# Altium project USBHUB.PrjPcb
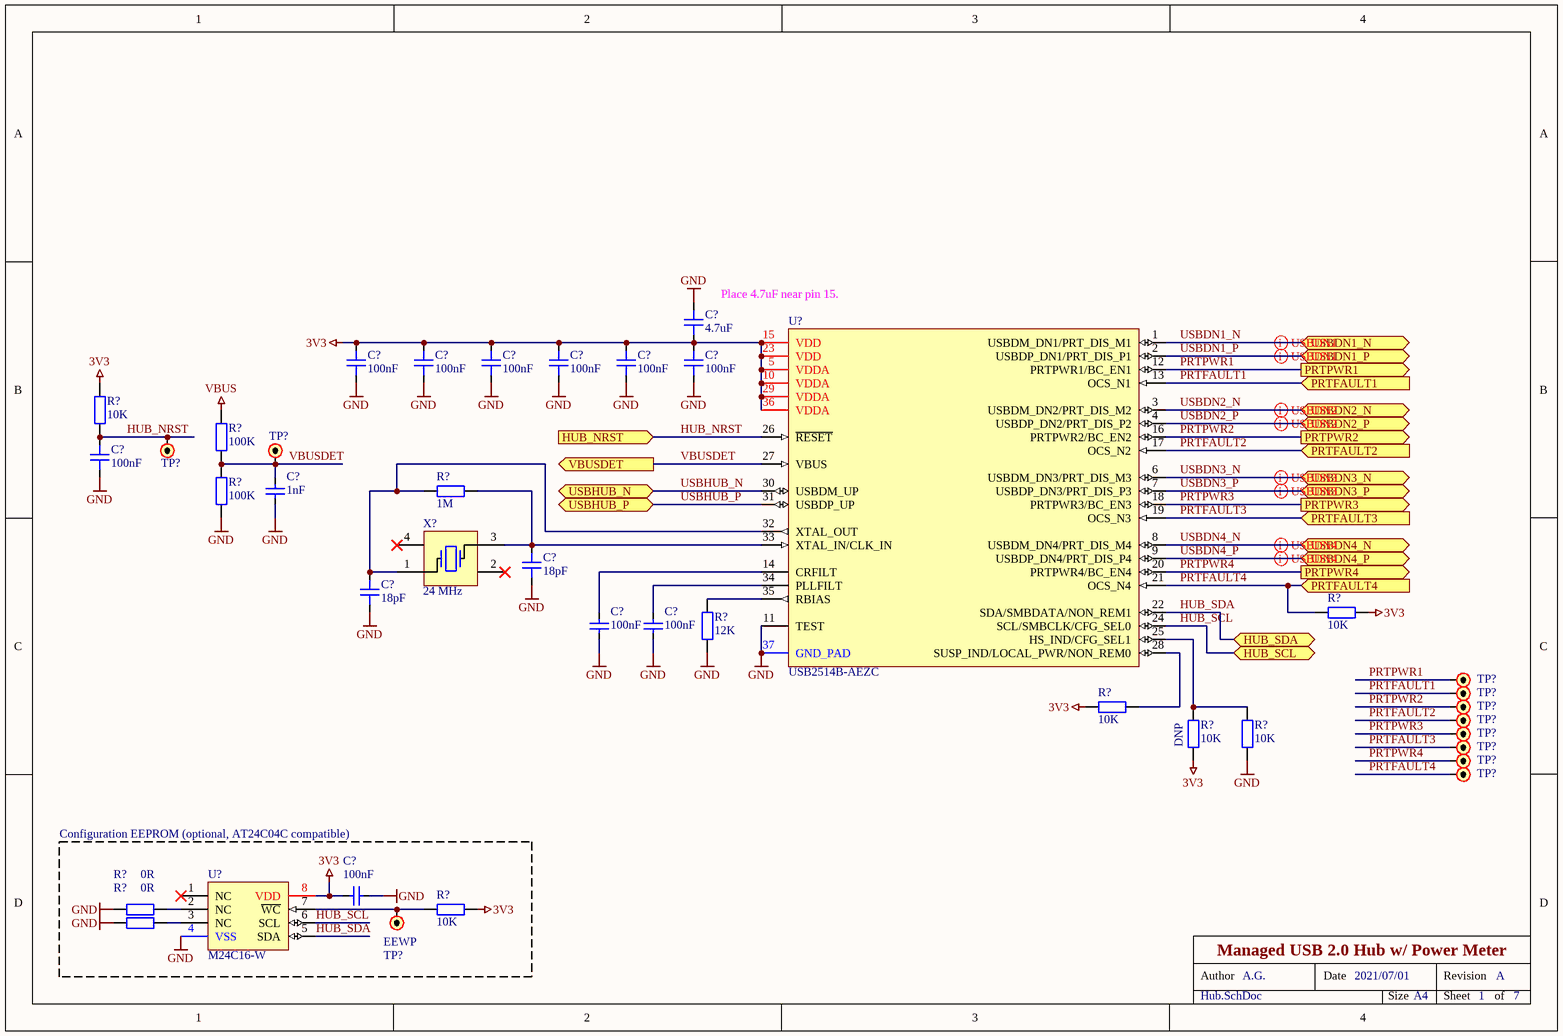
[diagram p0: Hub.SchDoc]
Title: Managed USB 2.0 Hub w/ Power Meter; Revision: A; DrawnBy: A.G.; Date: 2021/07/01
8 sheets, 301 parts. Net scope: flat (ports and power ports of the same name join across sheets).
Board file: USBHUB.PcbDoc
Sheets:
  Hub.SchDoc
  Control.SchDoc
  Ports.SchDoc
  PowerSupply.SchDoc
  PortSwitch.SchDoc
  UpstreamPort.SchDoc
  SMPS.SchDoc
  Decoration.SchDoc

## Sheet Hub.SchDoc: Managed USB 2.0 Hub w/ Power Meter
size A4; Date: 2021/07/01; DrawnBy: A.G.; DocumentNumber: 1; Revision: A; SheetNumber: 1; SheetTotal: 7; ProjectName: USBHUB.PrjPcb

### Parts
(Parts that share a designator on the sheet are numbered #1, #2 ... from top to bottom, then left to right.)
C?#1  4.7uF  [0603C_RF_M]
C?#2  100nF  [0603C_RF_M]
C?#3  100nF  [0603C_RF_M]
C?#4  100nF  [0603C_RF_M]
C?#5  100nF  [0603C_RF_M]
C?#6  100nF  [0603C_RF_M]
C?#7  100nF  [0603C_RF_M]
C?#8  100nF  [0603C_RF_M]
C?#9  1nF  [0603C_RF_M]
C?#10  18pF  [0603C_RF_M]
C?#11  18pF  [0603C_RF_M]
C?#12  100nF  [0603C_RF_M]
C?#13  100nF  [0603C_RF_M]
C?#14  100nF  [0603C_RF_M]
R?#1  10K  [0603R_RF_M]
R?#2  100K  [0603R_RF_M]
R?#3  1M  [0603R_RF_M]
R?#4  100K  [0603R_RF_M]
R?#5  10K  [0603R_RF_M]
R?#6  12K  [0603R_RF_M]
R?#7  10K  [0603R_RF_M]
R?#8  10K  [0603R_RF_M]
R?#9  10K  [0603R_RF_M]
R?#10  0R  [0603R_RF_M]
R?#11  10K  [0603R_RF_M]
R?#12  0R  [0603R_RF_M]
TP?#1  Test Point  [PAD_R_1MM]  (value not drawn)
TP?#2  Test Point  [PAD_R_1.5MM]  (value not drawn)
TP?#3  Test Point  [PAD_R_1.5MM]  (value not drawn)
TP?#4  Test Point  [PAD_R_1.5MM]  (value not drawn)
TP?#5  Test Point  [PAD_R_1.5MM]  (value not drawn)
TP?#6  Test Point  [PAD_R_1.5MM]  (value not drawn)
TP?#7  Test Point  [PAD_R_1.5MM]  (value not drawn)
TP?#8  Test Point  [PAD_R_1.5MM]  (value not drawn)
TP?#9  Test Point  [PAD_R_1.5MM]  (value not drawn)
TP?#10  Test Point  [PAD_R_1.5MM]  (value not drawn)
TP?#11  EEWP  [PAD_R_1.5MM]
U?#1  USB2514B-AEZC  [MCHP_USB2514B-QFN-36]
U?#2  M24C16-W  [SO-8-SOIC127P600X175-8N]
X?#1  24 MHz  [XTAL_5032]

### Blocks framed on the sheet
Configuration EEPROM (optional, AT24C04C compatible): C?#14 R?#10-R?#12 TP?#11 U?#2

### Ports
HUB_NRST (in), HUB_SCL (bidir), HUB_SDA (bidir), PRTFAULT1 (in), PRTFAULT2 (in), PRTFAULT3 (in), PRTFAULT4 (in), PRTPWR1 (out), PRTPWR2 (out), PRTPWR3 (out), PRTPWR4 (out), USBDN1_N (bidir), USBDN1_P (bidir), USBDN2_N (bidir), USBDN2_P (bidir), USBDN3_N (bidir), USBDN3_P (bidir), USBDN4_N (bidir), USBDN4_P (bidir), USBHUB_N (bidir), USBHUB_P (bidir), VBUSDET (out)

### Nets
3V3: C?#1.2 C?#2.2 C?#3.2 C?#4.2 C?#5.2 C?#6.2 C?#7.2 C?#14.2 R?#1.2 R?#5.1 R?#7.1 R?#8.1 R?#11.2 U?#1.5(VDDA) U?#1.10(VDDA) U?#1.15(VDD) U?#1.23(VDD) U?#1.29(VDDA) U?#1.36(VDDA) U?#2.8(VDD)
GND: C?#1.1 C?#2.1 C?#3.1 C?#4.1 C?#5.1 C?#6.1 C?#7.1 C?#8.1 C?#9.1 C?#10.1 C?#11.1 C?#12.1 C?#13.1 C?#14.1 R?#4.1 R?#6.1 R?#9.1 R?#10.1 R?#12.1 U?#1.11(TEST) U?#1.37(GND_PAD) U?#2.4(VSS)
VBUS: R?#2.2
HUB_NRST: C?#8.2 R?#1.1 TP?#1.1 U?#1.26(~{RESET}) ; port HUB_NRST
HUB_SCL: U?#1.24(SCL/SMBCLK/CFG_SEL0) U?#2.6(SCL) ; port HUB_SCL
HUB_SDA: U?#1.22(SDA/SMBDATA/NON_REM1) U?#2.5(SDA) ; port HUB_SDA
PRTFAULT1: TP?#4.1 U?#1.13(OCS_N1) ; port PRTFAULT1
PRTFAULT2: TP?#6.1 U?#1.17(OCS_N2) ; port PRTFAULT2
PRTFAULT3: TP?#8.1 U?#1.19(OCS_N3) ; port PRTFAULT3
PRTFAULT4: R?#5.2 TP?#10.1 U?#1.21(OCS_N4) ; port PRTFAULT4
PRTPWR1: TP?#3.1 U?#1.12(PRTPWR1/BC_EN1) ; port PRTPWR1
PRTPWR2: TP?#5.1 U?#1.16(PRTPWR2/BC_EN2) ; port PRTPWR2
PRTPWR3: TP?#7.1 U?#1.18(PRTPWR3/BC_EN3) ; port PRTPWR3
PRTPWR4: TP?#9.1 U?#1.20(PRTPWR4/BC_EN4) ; port PRTPWR4
USBDN1_N: U?#1.1(USBDM_DN1/PRT_DIS_M1) ; port USBDN1_N
USBDN1_P: U?#1.2(USBDP_DN1/PRT_DIS_P1) ; port USBDN1_P
USBDN2_N: U?#1.3(USBDM_DN2/PRT_DIS_M2) ; port USBDN2_N
USBDN2_P: U?#1.4(USBDP_DN2/PRT_DIS_P2) ; port USBDN2_P
USBDN3_N: U?#1.6(USBDM_DN3/PRT_DIS_M3) ; port USBDN3_N
USBDN3_P: U?#1.7(USBDP_DN3/PRT_DIS_P3) ; port USBDN3_P
USBDN4_N: U?#1.8(USBDM_DN4/PRT_DIS_M4) ; port USBDN4_N
USBDN4_P: U?#1.9(USBDP_DN4/PRT_DIS_P4) ; port USBDN4_P
USBHUB_N: U?#1.30(USBDM_UP) ; port USBHUB_N
USBHUB_P: U?#1.31(USBDP_UP) ; port USBHUB_P
VBUSDET: C?#9.2 R?#2.1 R?#4.2 TP?#2.1 U?#1.27(VBUS) ; port VBUSDET
NetC?#10_2: C?#10.2 R?#3.2 U?#1.33(XTAL_IN/CLK_IN) X?#1.3(X2)
NetC?#11_2: C?#11.2 R?#3.1 U?#1.32(XTAL_OUT) X?#1.1(X1)
NetC?#12_2: C?#12.2 U?#1.14(CRFILT)
NetC?#13_2: C?#13.2 U?#1.34(PLLFILT)
NetR?#6_2: R?#6.2 U?#1.35(RBIAS)
NetR?#7_2: R?#7.2 U?#1.28(SUSP_IND/LOCAL_PWR/NON_REM0)
NetR?#8_2: R?#8.2 R?#9.2 U?#1.25(HS_IND/CFG_SEL1)
NetR?#10_2: R?#10.2 U?#2.2(NC)
NetR?#11_1: R?#11.1 TP?#11.1 U?#2.7(~{WC})
NetR?#12_2: R?#12.2 U?#2.3(NC)

Not connected (* = marked no-connect by the designer): U?#2 1(NC)*; X?#1 2(GND)* 4(GND)*

### Layout directives
differential pair: USBDN1_N, USBDN1_P, USBDN2_N, USBDN2_P, USBDN3_N, USBDN3_P, USBDN4_N, USBDN4_P

### Notes on the sheet
- Place 4.7uF near pin 15.
- (near R?#8) DNP
- Author
- Date
- Revision
- Size
- A4
- Sheet
- of

### Library data of the parts
C?#1-C?#14 = C: Capacitor; Manufacturer: Generic Brand; Max Voltage: ? V; Tolerance: ?; Mounting Technology: SMT; Tag: *; Manufacturer Part No: *; Supplier: *; Supplier Link: http://; Supplier Part No: *; Category: Capacitor
  C?#1: Value: 4.7uF
  C?#2-C?#8 C?#12-C?#14: Value: 100nF
  C?#9: Value: 1nF
  C?#10 C?#11: Value: 18pF
R?#1-R?#12 = R: Resistor; Manufacturer: Generic Brand; Power Rating: ? W; Max Voltage: ? V; Tolerance: ?; Supplier Link: http://; Category: Resistor; Mounting Technology: SMT
  R?#1 R?#5 R?#7-R?#9 R?#11: Value: 10K
  R?#2 R?#4: Value: 100K
  R?#3: Value: 1M
  R?#6: Value: 12K
  R?#10 R?#12: Value: 0R
TP?#1-TP?#11 = Test Point: Test Point / Pad
U?#1 = USB2514B-AEZC: USB 2.0 Hub Controller; Manufacturer: Microchip; Supplier Link: https://www.chipdip.by/product/usb2514b-aezc-microchip; Supplier Part No: 9000221010; Mounting Type: SMT; Case: QFN-36; Supplier: Chipdip; Product Name: USB2514B-AEZC
U?#2 = M24C16-W: IC SRL EEPROM 16KBIT 2.5V 8-SOIC; Manufacturer: STMicroelectronics; Manufacturer Product Number: M24C16-WMN6TP; Base Product Number: M24C16; Supplier: DigiKey; Supplier URL: https://www.digikey.com/en/products/detail/stmicroelectronics/M24C16-WMN6TP/1007246; Supplier Part No: 497-17785-1-ND; Supplier Package: Cut Tape; Mounting Type: SMT; Operating Temperature: -40°C ~ 85°C (TA); Supplier Price: $0.14
X?#1 = XT-4P: Crystal Resonator (4 Leads); Manufacturer: Generic Brand; Tolerance: ? ppm; Mounting Technology: SMT; Supplier Link: http://; Category: Crystal; Value: 24 MHz

## Sheet Control.SchDoc: Managed USB 2.0 Hub w/ Power Meter
size A4; Date: 2021/07/01; DrawnBy: A.G.; DocumentNumber: 1; Revision: A; SheetNumber: 2; SheetTotal: 7; ProjectName: USBHUB.PrjPcb
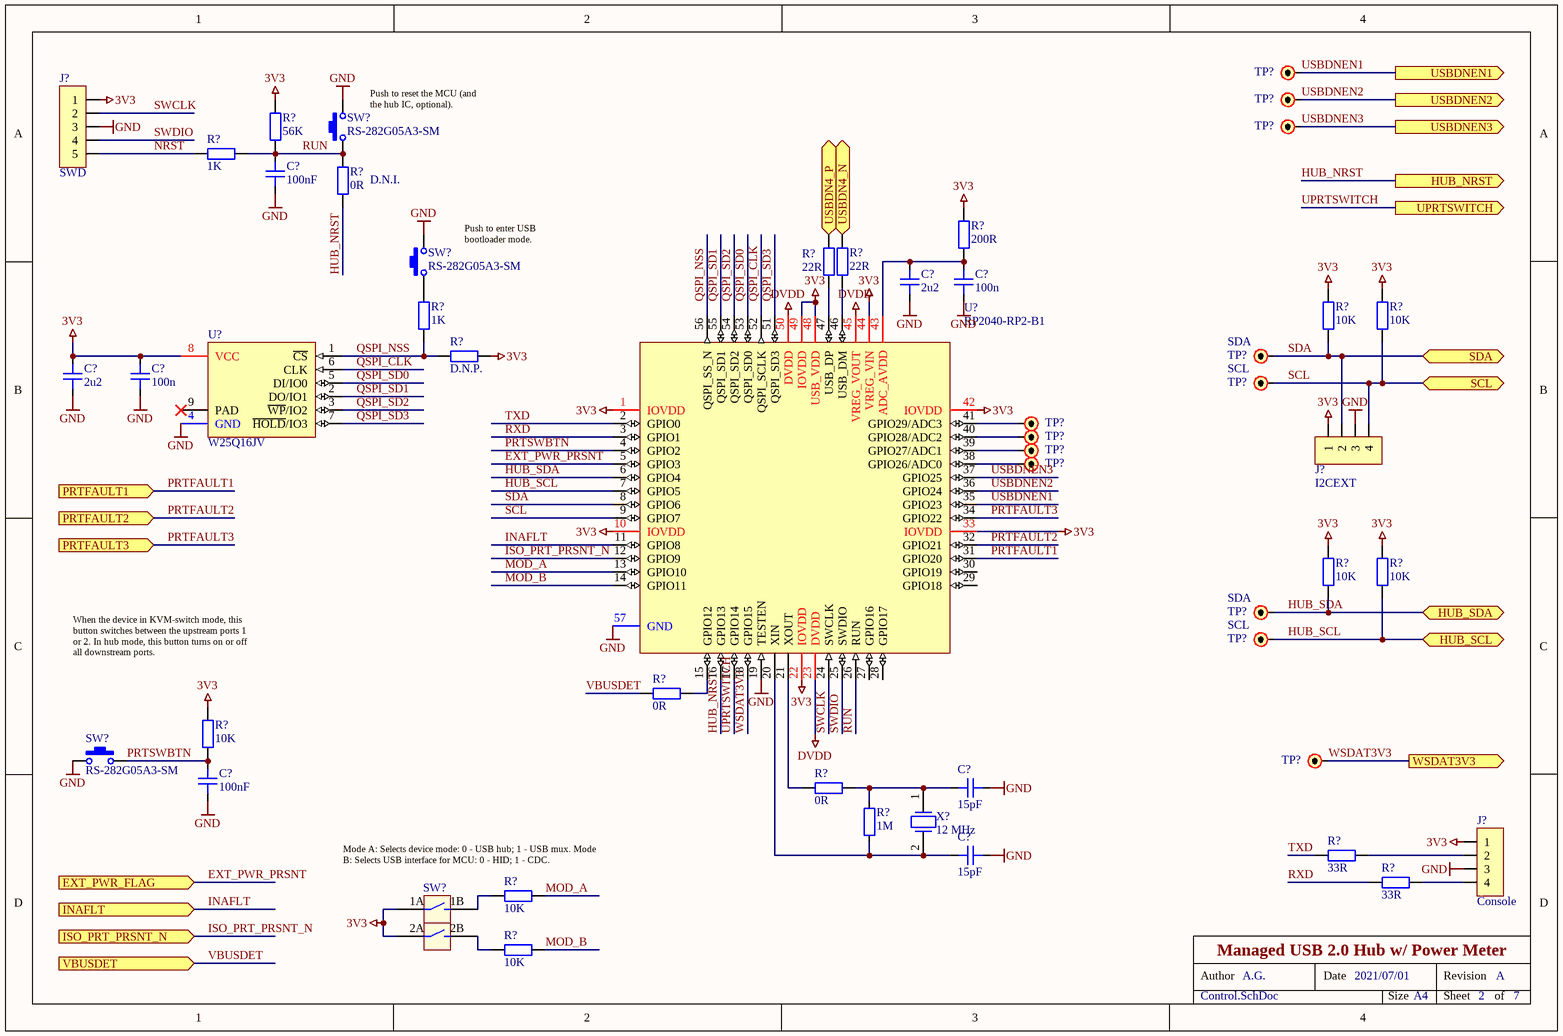
[diagram p1: Control.SchDoc]

### Parts
(Parts that share a designator on the sheet are numbered #1, #2 ... from top to bottom, then left to right.)
C?#15  100nF  [0603C_RF_M]
C?#16  2u2  [0805C_RF_M]
C?#17  100n  [0805C_RF_M]
C?#18  2u2  [0603C_RF_M]
C?#19  100n  [0603C_RF_M]
C?#20  100nF  [0603C_RF_M]
C?#21  15pF  [0603C_RF_M]
C?#22  15pF  [0603C_RF_M]
J?#1  SWD  [HEADER-2.54-5P1]
J?#2  I2CEXT  [HEADER-2.54-4P1]
J?#3  Console  [HEADER-2.54-4P1]
R?#13  56K  [0603R_RF_M]
R?#14  1K  [0603R_RF_M]
R?#15  0R  [0603R_RF_M]
R?#16  200R  [0805R_RF_M]
R?#17  1K  [0603R_RF_M]
R?#18  22R  [0805R_RF_M]
R?#19  22R  [0805R_RF_M]
R?#20  10K  [0603R_RF_M]
R?#21  10K  [0603R_RF_M]
R?#22  D.N.P.  [0603R_RF_M]
R?#23  10K  [0603R_RF_M]
R?#24  10K  [0603R_RF_M]
R?#25  0R  [0805R_RF_M]
R?#26  10K  [0805R_RF_M]
R?#27  0R  [0805R_RF_M]
R?#28  1M  [0805R_RF_M]
R?#29  33R  [0805R_RF_M]
R?#30  33R  [0805R_RF_M]
R?#31  10K  [0805R_RF_M]
R?#32  10K  [0805R_RF_M]
SW?#1  RS-282G05A3-SM  [RS-282G05A3-SM]
SW?#2  RS-282G05A3-SM  [RS-282G05A3-SM]
SW?#3  RS-282G05A3-SM  [RS-282G05A3-SM]
SW?#4  WURTH_418117270902  [WURTH_418117270902]  (value not drawn)
TP?#12  Test Point  [PAD_R_1MM]  (value not drawn)
TP?#13  Test Point  [PAD_R_1MM]  (value not drawn)
TP?#14  Test Point  [PAD_R_1MM]  (value not drawn)
TP?#15  SDA  [PAD_R_1.5MM]
TP?#16  SCL  [PAD_R_1.5MM]
TP?#17  Test Point  [PAD_R_1MM]  (value not drawn)
TP?#18  Test Point  [PAD_R_1MM]  (value not drawn)
TP?#19  Test Point  [PAD_R_1MM]  (value not drawn)
TP?#20  Test Point  [PAD_R_1MM]  (value not drawn)
TP?#21  SDA  [PAD_R_1.5MM]
TP?#22  SCL  [PAD_R_1.5MM]
TP?#23  Test Point  [PAD_R_1MM]  (value not drawn)
U?#3  W25Q16JV  [MCHP_USON-8]
U?#4  RP2040-RP2-B1  [RP2040-QFN-56]
X?#2  12 MHz  [XTAL_3215]

### Ports
EXT_PWR_FLAG (in), HUB_NRST (out), HUB_SCL (bidir), HUB_SDA (bidir), INAFLT (in), ISO_PRT_PRSNT_N (in), PRTFAULT1 (in), PRTFAULT2 (in), PRTFAULT3 (in), SCL (bidir), SDA (bidir), UPRTSWITCH (out), USBDN4_N (bidir), USBDN4_P (bidir), USBDNEN1 (out), USBDNEN2 (out), USBDNEN3 (out), VBUSDET (in), WSDAT3V3 (out)

### Nets
3V3: C?#18.2 C?#19.2 J?#1.1 J?#2.1 J?#3.1 R?#13.1 R?#16.2 R?#20.2 R?#21.2 R?#22.1 R?#23.2 R?#24.2 R?#26.2 U?#3.8(VCC) U?#4.1(IOVDD) U?#4.10(IOVDD) U?#4.22(IOVDD) U?#4.33(IOVDD) U?#4.42(IOVDD) U?#4.44(VREG_VIN) U?#4.48(USB_VDD) U?#4.49(IOVDD)
DVDD: U?#4.23(DVDD) U?#4.45(VREG_VOUT) U?#4.50(DVDD)
GND: C?#15.1 C?#16.1 C?#17.1 C?#18.1 C?#19.1 C?#20.2 C?#21.2 C?#22.2 J?#1.3 J?#2.3 J?#3.3 SW?#1.2 SW?#2.2 SW?#3.1 U?#3.4(GND) U?#4.19(TESTEN) U?#4.57(GND)
EXT_PWR_PRSNT: U?#4.5(GPIO3) ; port EXT_PWR_FLAG
HUB_NRST: R?#15.2 U?#4.16(GPIO13) ; port HUB_NRST
HUB_SCL: R?#24.1 TP?#22.1 U?#4.7(GPIO5) ; port HUB_SCL
HUB_SDA: R?#23.1 TP?#21.1 U?#4.6(GPIO4) ; port HUB_SDA
INAFLT: U?#4.11(GPIO8) ; port INAFLT
ISO_PRT_PRSNT_N: U?#4.12(GPIO9) ; port ISO_PRT_PRSNT_N
MOD_A: R?#31.2 U?#4.13(GPIO10)
MOD_B: R?#32.2 U?#4.14(GPIO11)
NRST: J?#1.5 R?#14.2
PRTFAULT1: U?#4.31(GPIO20) ; port PRTFAULT1
PRTFAULT2: U?#4.32(GPIO21) ; port PRTFAULT2
PRTFAULT3: U?#4.34(GPIO22) ; port PRTFAULT3
PRTSWBTN: C?#20.1 R?#26.1 SW?#3.2 U?#4.4(GPIO2)
QSPI_CLK: U?#3.6(CLK) U?#4.52(QSPI_SCLK)
QSPI_NSS: R?#17.2 R?#22.2 U?#3.1(~{CS}) U?#4.56(QSPI_SS_N)
QSPI_SD0: U?#3.5(DI/IO0) U?#4.53(QSPI_SD0)
QSPI_SD1: U?#3.2(DO/IO1) U?#4.55(QSPI_SD1)
QSPI_SD2: U?#3.3(~{WP}/IO2) U?#4.54(QSPI_SD2)
QSPI_SD3: U?#3.7(~{HOLD}/IO3) U?#4.51(QSPI_SD3)
RUN: C?#15.2 R?#13.2 R?#14.1 R?#15.1 SW?#1.1 U?#4.26(RUN)
RXD: R?#30.1 U?#4.3(GPIO1)
SCL: J?#2.4 R?#21.1 TP?#16.1 U?#4.9(GPIO7) ; port SCL
SDA: J?#2.2 R?#20.1 TP?#15.1 U?#4.8(GPIO6) ; port SDA
SWCLK: J?#1.2 U?#4.24(SWCLK)
SWDIO: J?#1.4 U?#4.25(SWDIO)
TXD: R?#29.1 U?#4.2(GPIO0)
UPRTSWITCH: U?#4.17(GPIO14) ; port UPRTSWITCH
USBDN4_N: R?#19.2 ; port USBDN4_N
USBDN4_P: R?#18.2 ; port USBDN4_P
USBDNEN1: TP?#12.1 U?#4.35(GPIO23) ; port USBDNEN1
USBDNEN2: TP?#13.1 U?#4.36(GPIO24) ; port USBDNEN2
USBDNEN3: TP?#14.1 U?#4.37(GPIO25) ; port USBDNEN3
VBUSDET: R?#25.2 ; port VBUSDET
WSDAT3V3: TP?#23.1 U?#4.18(GPIO15) ; port WSDAT3V3
NetC?#16_2: C?#16.2 C?#17.2 R?#16.1 U?#4.43(ADC_AVDD)
NetC?#21_1: C?#21.1 R?#27.1 R?#28.2 X?#2.1
NetC?#22_1: C?#22.1 R?#28.1 U?#4.20(XIN) X?#2.2
NetJ?#3_2: J?#3.2 R?#29.2
NetJ?#3_4: J?#3.4 R?#30.2
NetR?#17_1: R?#17.1 SW?#2.1
NetR?#18_1: R?#18.1 U?#4.47(USB_DP)
NetR?#19_1: R?#19.1 U?#4.46(USB_DM)
NetR?#25_1: R?#25.1 U?#4.15(GPIO12)
NetR?#27_2: R?#27.2 U?#4.21(XOUT)
NetTP?#17_1: TP?#17.1 U?#4.41(GPIO29/ADC3)
NetTP?#18_1: TP?#18.1 U?#4.40(GPIO28/ADC2)
NetTP?#19_1: TP?#19.1 U?#4.39(GPIO27/ADC1)
NetTP?#20_1: TP?#20.1 U?#4.38(GPIO26/ADC0)

Not connected (* = marked no-connect by the designer): R?#31 1; R?#32 1; SW?#4 1A 1B 2A 2B; U?#3 9(PAD)*; U?#4 27(GPIO16) 28(GPIO17) 29(GPIO18) 30(GPIO19)

### Notes on the sheet
- (near SW?#1) Push to reset the MCU (and the hub IC, optional).
- D.N.I.
- (near SW?#2) Push to enter USB bootloader mode.
- When the device in KVM-switch mode, this button switches between the upstream ports 1 or 2. In hub mode, this button turns on or off all downstream ports.
- Mode A: Selects device mode: 0 - USB hub; 1 - USB mux. Mode B: Selects USB interface for MCU: 0 - HID; 1 - CDC.
- Author
- Date
- Revision
- Size
- A4
- Sheet
- of

### Library data of the parts
C?#15-C?#22 = C: as C?#1 on sheet Hub; Tolerance: ?; Mounting Technology: SMT; Tag: *; Manufacturer Part No: *; Supplier: *; Supplier Link: http://; Supplier Part No: *; Category: Capacitor
  C?#15 C?#20: Value: 100nF
  C?#16 C?#18: Value: 2u2
  C?#17 C?#19: Value: 100n
  C?#21 C?#22: Value: 15pF
J?#1 = PINHDR-5P1: Generic Pin Header 5x1
J?#2 J?#3 = PINHDR-4P1: Generic Pin Header 4x1
R?#13-R?#32 = R: as R?#1 on sheet Hub; Tolerance: ?; Supplier Link: http://; Category: Resistor; Mounting Technology: SMT
  R?#13: Value: 56K
  R?#14 R?#17: Value: 1K
  R?#15 R?#25 R?#27: Value: 0R
  R?#16: Value: 200R
  R?#18 R?#19: Value: 22R
  R?#20 R?#21 R?#23 R?#24 R?#26 R?#31 R?#32: Value: 10K
  R?#22: Value: D.N.P.
  R?#28: Value: 1M
  R?#29 R?#30: Value: 33R
SW?#1-SW?#3 = RS-282G05A3-SM: SWITCH TACTILE SPST-NO 0.05A 12V; Manufacturer: C&K; Product Number: RS-282G05A3-SM RT; Supplier: DigiKey; Supplier Link: https://www.digikey.com/en/products/detail/c-k/RS-282G05A3-SM-RT/2747190; Supplier Part No: CKN10384CT-ND; Mounting Technology: SMT; Package: Non-Standard
SW?#4 = WURTH_418117270902: DIP SWITCH SPST 2.54 PITCH RA; Manufacturer: Wurth Elektronik; Compatible Product: DS1040-02RN; Product Number: 418117270902; Mounting Technology: SMT; Package: DIP-4; Supplier: DigiKey; Supplier Link: https://www.digikey.com/en/products/detail/w%C3%BCrth-elektronik/418117270902/3174485; Supplier Part No: 732-3832-5-ND; Alternative Supplier: Chipdip; Alternative Supplier Part No: 9000190955; Alternative Supplier Link: https://www.chipdip.by/product/ds1040-02rn
TP?#12-TP?#23 = Test Point: Test Point / Pad
U?#3 = W25Q16JV: IC FLASH 16MBIT SPI/QUAD 8USON
U?#4 = RP2040-RP2-B1: IC MCU; Manufacturer: Raspberry Pi Foundation; Supplier: DigiKey; Package: VFQFN-56; Mounting Technology: SMT
X?#2 = XT-2P: Crystal Resonator (2 Leads); Manufacturer: Generic Brand; Tolerance: ? ppm; Mounting Technology: SMT; Supplier Link: http://; Category: Crystal; Value: 12 MHz

## Sheet Ports.SchDoc: Managed USB 2.0 Hub w/ Power Meter
size A4; Date: 2021/07/01; DrawnBy: A.G.; DocumentNumber: 1; Revision: A; SheetNumber: 3; SheetTotal: 7; ProjectName: USBHUB.PrjPcb
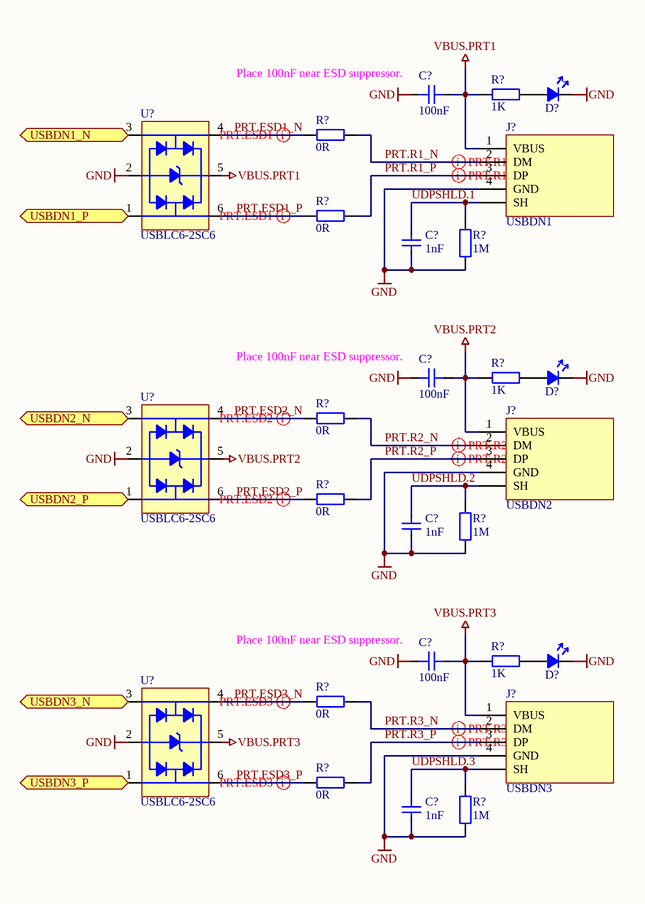
[diagram p2: Ports.SchDoc]

### Parts
(Parts that share a designator on the sheet are numbered #1, #2 ... from top to bottom, then left to right.)
C?#23  100nF  [0603C_RF_M]
C?#24  1nF  [0603C_RF_M]
C?#25  100nF  [0603C_RF_M]
C?#26  1nF  [0603C_RF_M]
C?#27  100nF  [0603C_RF_M]
C?#28  1nF  [0603C_RF_M]
D?#1  Unspecified  [0805LED_RF_M]  (value not drawn)
D?#2  Unspecified  [0805LED_RF_M]  (value not drawn)
D?#3  Unspecified  [0805LED_RF_M]  (value not drawn)
J?#4  USBDN1  [SAMTEC_USB-A-S-X-X-TH]
J?#5  USBDN2  [SAMTEC_USB-A-S-X-X-TH]
J?#6  USBDN3  [SAMTEC_USB-A-S-X-X-TH]
R?#33  1K  [0603R_RF_M]
R?#34  0R  [0603R_RF_M]
R?#35  0R  [0603R_RF_M]
R?#36  1M  [0603R_RF_M]
R?#37  1K  [0603R_RF_M]
R?#38  0R  [0603R_RF_M]
R?#39  0R  [0603R_RF_M]
R?#40  1M  [0603R_RF_M]
R?#41  1K  [0603R_RF_M]
R?#42  0R  [0603R_RF_M]
R?#43  0R  [0603R_RF_M]
R?#44  1M  [0603R_RF_M]
U?#5  USBLC6-2SC6  [TI_SOT-23-6]
U?#6  USBLC6-2SC6  [TI_SOT-23-6]
U?#7  USBLC6-2SC6  [TI_SOT-23-6]

### Ports
USBDN1_N (bidir), USBDN1_P (bidir), USBDN2_N (bidir), USBDN2_P (bidir), USBDN3_N (bidir), USBDN3_P (bidir)

### Nets
GND: C?#23.1 C?#24.1 C?#25.1 C?#26.1 C?#27.1 C?#28.1 D?#1.C D?#2.C D?#3.C J?#4.4(GND) J?#5.4(GND) J?#6.4(GND) R?#36.1 R?#40.1 R?#44.1 U?#5.2 U?#6.2 U?#7.2
VBUS.PRT1: C?#23.2 J?#4.1(VBUS) R?#33.1 U?#5.5
VBUS.PRT2: C?#25.2 J?#5.1(VBUS) R?#37.1 U?#6.5
VBUS.PRT3: C?#27.2 J?#6.1(VBUS) R?#41.1 U?#7.5
PRT.ESD1_N: R?#34.1 U?#5.4
PRT.ESD1_P: R?#35.1 U?#5.6
PRT.ESD2_N: R?#38.1 U?#6.4
PRT.ESD2_P: R?#39.1 U?#6.6
PRT.ESD3_N: R?#42.1 U?#7.4
PRT.ESD3_P: R?#43.1 U?#7.6
PRT.R1_N: J?#4.2(DM) R?#34.2
PRT.R1_P: J?#4.3(DP) R?#35.2
PRT.R2_N: J?#5.2(DM) R?#38.2
PRT.R2_P: J?#5.3(DP) R?#39.2
PRT.R3_N: J?#6.2(DM) R?#42.2
PRT.R3_P: J?#6.3(DP) R?#43.2
UDPSHLD.1: C?#24.2 J?#4.SH R?#36.2
UDPSHLD.2: C?#26.2 J?#5.SH R?#40.2
UDPSHLD.3: C?#28.2 J?#6.SH R?#44.2
USBDN1_N: U?#5.3 ; port USBDN1_N
USBDN1_P: U?#5.1 ; port USBDN1_P
USBDN2_N: U?#6.3 ; port USBDN2_N
USBDN2_P: U?#6.1 ; port USBDN2_P
USBDN3_N: U?#7.3 ; port USBDN3_N
USBDN3_P: U?#7.1 ; port USBDN3_P
NetD?#1_A: D?#1.A R?#33.2
NetD?#2_A: D?#2.A R?#37.2
NetD?#3_A: D?#3.A R?#41.2

### Layout directives
differential pair: PRT.ESD1_N, PRT.ESD1_P, PRT.ESD2_N, PRT.ESD2_P, PRT.ESD3_N, PRT.ESD3_P, PRT.R1_N, PRT.R1_P, PRT.R2_N, PRT.R2_P, PRT.R3_N, PRT.R3_P

### Notes on the sheet
- (near C?#23) Place 100nF near ESD suppressor.
- (near C?#25) Place 100nF near ESD suppressor.
- (near C?#27) Place 100nF near ESD suppressor.
- Author
- Date
- Revision
- Size
- A4
- Sheet
- of

### Library data of the parts
C?#23-C?#28 = C: as C?#1 on sheet Hub; Tolerance: ?; Mounting Technology: SMT; Manufacturer Part No: *; Supplier: *; Supplier Link: http://; Supplier Part No: *; Category: Capacitor
  C?#23 C?#25 C?#27: Value: 100nF; Tag: *
  C?#24 C?#26 C?#28: Value: 1nF
D?#1-D?#3 = LED: Manufacturer: Generic Brand; Forward Voltage Drop: ? V; Emitting Color: Unspecified; Manufacturer Part No: *; Supplier: *; Supplier Link: http://; Supplier Part No: *; Category: Diode; Mounting Technology: SMT
J?#4-J?#6 = USB-A-S-S-W-TH: CONN RCPT USB2.0 TYPEA 4POS R/A; Manufacturer: Samtec Inc.; Supplier: DigiKey; Mounting Type: THT; Supplier Link: https://www.digikey.com/en/products/detail/samtec-inc/USB-A-S-S-W-TH/6679110; Supplier Part No: SAM10373-ND; Product Number: USB-A-S-S-W-TH
R?#33-R?#35 R?#37-R?#39 R?#41-R?#43 = R: as R?#1 on sheet Hub; Tolerance: ?; Supplier Link: http://; Category: Resistor; Mounting Technology: SMT
  R?#33 R?#37 R?#41: Value: 1K
  R?#34 R?#35 R?#38 R?#39 R?#42 R?#43: Value: 0R
R?#36 R?#40 R?#44 = R: Resistor; Manufacturer: Generic Brand; Max Voltage: ? V; Power Rating: ? W; Value: 1M; Tolerance: ?; Manufacturer Part No: *; Supplier: *; Supplier Link: http://; Supplier Part No: *; Category: Resistor; Mounting Technology: SMT
U?#5-U?#7 = USBLC6-2SC6: Low Capacitance USB ESD Protection; Manufacturer: STMicroelectronics; Supplier Link: https://www.chipdip.by/product/usblc6-2sc6; Supplier Part No: 9000039051; Supplier: Chipdip; Case: SOT-23-6; Mounting Type: SMT; Product Name: USBLC6-2SC6

## Sheet PowerSupply.SchDoc: Managed USB 2.0 Hub w/ Power Meter
size A4; Date: 2021/07/01; DrawnBy: A.G.; DocumentNumber: 1; Revision: A; SheetNumber: 4; SheetTotal: 7; ProjectName: USBHUB.PrjPcb
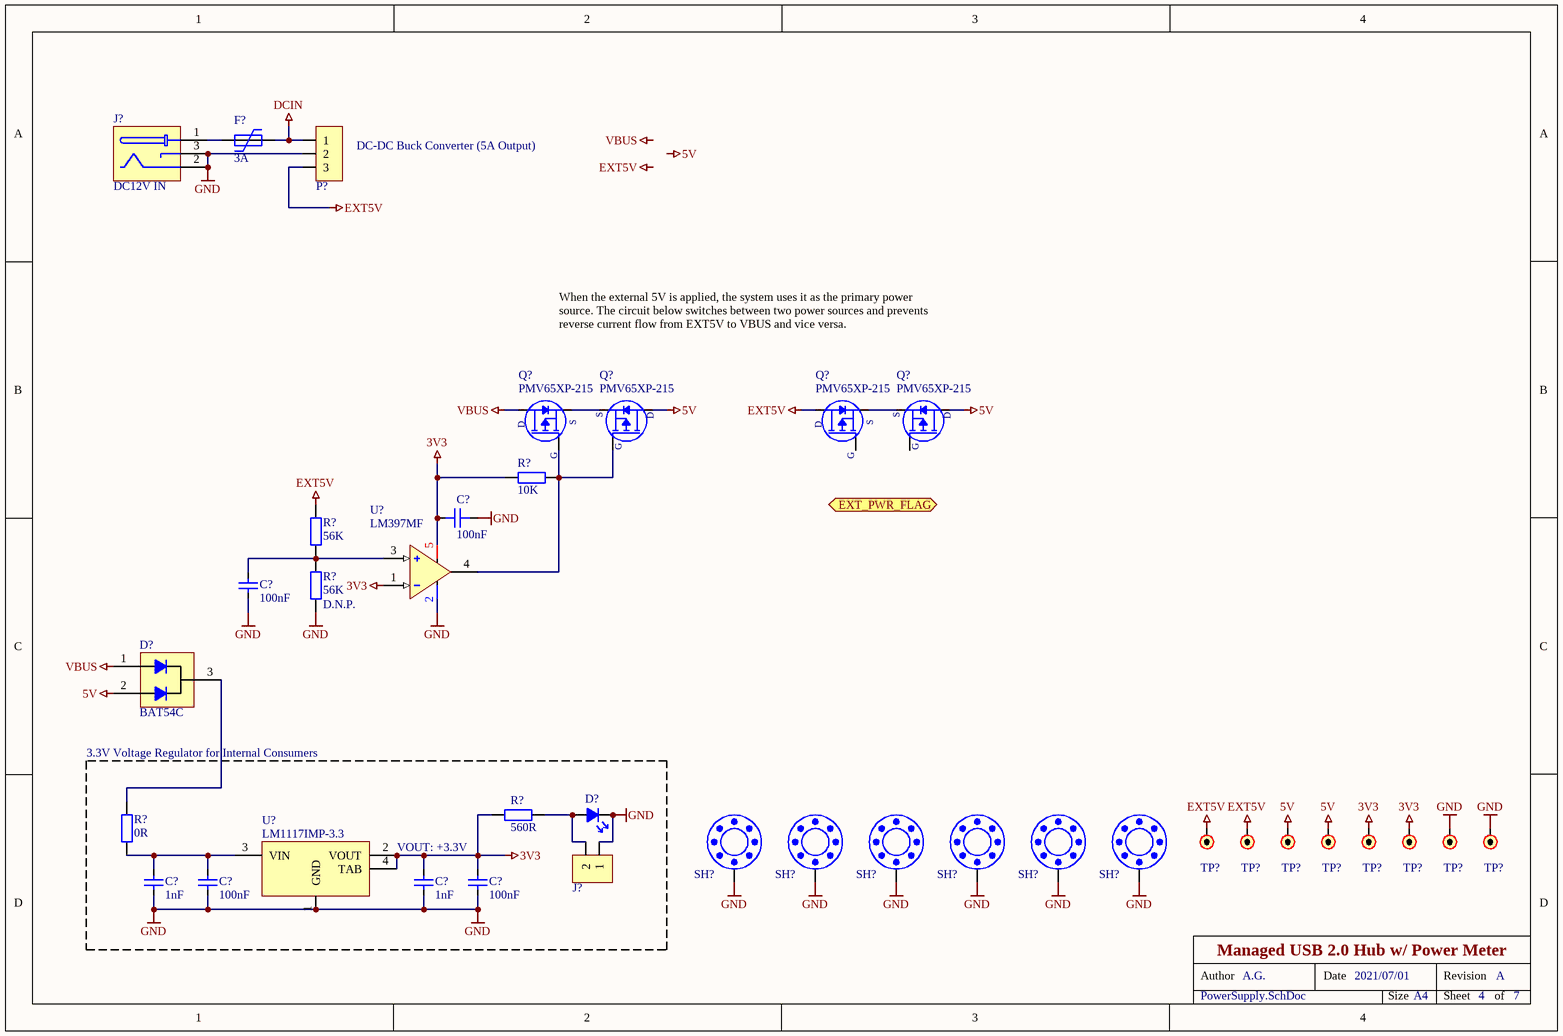
[diagram p3: PowerSupply.SchDoc]

### Parts
(Parts that share a designator on the sheet are numbered #1, #2 ... from top to bottom, then left to right.)
C?#29  100nF  [0603C_RF_M]
C?#30  100nF  [0603C_RF_M]
C?#31  1nF  [0603C_RF_M]
C?#32  100nF  [0603C_RF_M]
C?#33  1nF  [0603C_RF_M]
C?#34  100nF  [0603C_RF_M]
D?#4  BAT54C  [IRLML_SOT-23]
D?#5  LED  [0805LED_RF_M]  (value not drawn)
F?#1  3A  [BOURNS_MF-MSMF110/16-2_RF_H]
J?#7  DC12V IN  [CON JACK PWR 2.5mm PJ-002BH - duplicate]
J?#8  PINHDR_2x1  [HEADER-2.54-2P1]  (value not drawn)
P?  ED500XDS-3  [ED500XDS-3]  (value not drawn)
Q?#1  PMV65XP-215  [IRLML_SOT-23]
Q?#2  PMV65XP-215  [IRLML_SOT-23]
Q?#3  PMV65XP-215  [IRLML_SOT-23]
Q?#4  PMV65XP-215  [IRLML_SOT-23]
R?#45  10K  [0805R_RF_M]
R?#46  56K  [0805R_RF_M]
R?#47  56K  [0805R_RF_M]
R?#48  560R  [0603R_RF_M]
R?#49  0R  [0603R_RF_M]
SH?#1  SH-30/57  [SH\D3.0\S5.7]  (value not drawn)
SH?#2  SH-30/57  [SH\D3.0\S5.7]  (value not drawn)
SH?#3  SH-30/57  [SH\D3.0\S5.7]  (value not drawn)
SH?#4  SH-30/57  [SH\D3.0\S5.7]  (value not drawn)
SH?#5  SH-30/57  [SH\D3.0\S5.7]  (value not drawn)
SH?#6  SH-30/57  [SH\D3.0\S5.7]  (value not drawn)
TP?#24  Test Point  [PAD_R_1.5MM]  (value not drawn)
TP?#25  Test Point  [PAD_R_1.5MM]  (value not drawn)
TP?#26  Test Point  [PAD_R_1.5MM]  (value not drawn)
TP?#27  Test Point  [PAD_R_1.5MM]  (value not drawn)
TP?#28  Test Point  [PAD_R_1.5MM]  (value not drawn)
TP?#29  Test Point  [PAD_R_1.5MM]  (value not drawn)
TP?#30  Test Point  [PAD_R_1.5MM]  (value not drawn)
TP?#31  Test Point  [PAD_R_1.5MM]  (value not drawn)
U?#8  LM397MF  [TI_SOT-23-5]
U?#9  LM1117IMP-3.3  VOUT: +3.3V  [SOT-223]

### Blocks framed on the sheet
3.3V Voltage Regulator for Internal Consumers: C?#31-C?#34 D?#5 J?#8 R?#48 R?#49 U?#9

### Ports
EXT_PWR_FLAG (out)

### Nets
3V3: C?#29.2 C?#33.2 C?#34.2 R?#45.1 R?#48.2 TP?#28.1 TP?#29.1 U?#8.1(INN) U?#8.5(VDD) U?#9.2(VOUT) U?#9.4(TAB)
5V: D?#4.2(A2) Q?#2.3(Drain) Q?#4.3(Drain) TP?#26.1 TP?#27.1
DCIN: F?#1.2 P?.1
EXT5V: P?.3 Q?#3.3(Drain) R?#46.1 TP?#24.1 TP?#25.1
GND: C?#29.1 C?#30.1 C?#31.1 C?#32.1 C?#33.1 C?#34.1 D?#5.C J?#7.2 J?#7.3 J?#8.1 P?.2 R?#47.2 SH?#1.1 SH?#2.1 SH?#3.1 SH?#4.1 SH?#5.1 SH?#6.1 TP?#30.1 TP?#31.1 U?#8.2(VSS) U?#9.1(GND)
VBUS: D?#4.1(A1) Q?#1.3(Drain)
NetC?#30_2: C?#30.2 R?#46.2 R?#47.1 U?#8.3(INP)
NetC?#31_2: C?#31.2 C?#32.2 R?#49.1 U?#9.3(VIN)
NetD?#4_3: D?#4.3(C) R?#49.2
NetD?#5_A: D?#5.A J?#8.2 R?#48.1
NetF?#1_1: F?#1.1 J?#7.1
NetQ?#1_1: Q?#1.1(Gate) Q?#2.1(Gate) R?#45.2 U?#8.4(OUT)
NetQ?#1_2: Q?#1.2(Source) Q?#2.2(Source)
NetQ?#3_2: Q?#3.2(Source) Q?#4.2(Source)

Not connected (* = marked no-connect by the designer): Q?#3 1(Gate); Q?#4 1(Gate)

### Notes on the sheet
- (near P?) DC-DC Buck Converter (5A Output)
- When the external 5V is applied, the system uses it as the primary power source. The circuit below switches between two power sources and prevents reverse current flow from EXT5V to VBUS and vice versa.
- (near R?#47) D.N.P.
- Labels drawn without touching a wire or pin: 5V, EXT5V, VBUS
- Author
- Date
- Revision
- Size
- A4
- Sheet
- of
- (in symbol PMV65XP-215) D; S; G

### Library data of the parts
C?#29-C?#34 = C: as C?#1 on sheet Hub; Tolerance: ?; Manufacturer Part No: *; Supplier: *; Supplier Link: http://; Supplier Part No: *; Category: Capacitor; Mounting Technology: SMT
  C?#29 C?#30 C?#32 C?#34: Value: 100nF
  C?#31 C?#33: Value: 1nF
D?#4 = BAT54C: DIODE ARRAY SCHOTTKY COMM CATH 30V 0.2A SOT-23; PartNo: BAT54C-FDICT-ND; Manufacturer: Diodes Incorporated; DiodeConfiguration: 1 Pair Common Cathode; ProductNumber: BAT54C-7-F; BaseProduct: BAT54C; Supplier: DigiKey; URL: https://www.digikey.com/en/products/detail/diodes-incorporated/BAT54C-7-F/717701; MountingTechnology: SMT; UnitPrice: $0.18; Package: SOT-23-3
D?#5 = LED: Manufacturer: Generic Brand; Emitting Color: Unspecified; Forward Voltage Drop: ? V; Manufacturer Part No: *; Supplier: *; Supplier Link: http://; Supplier Part No: *; Mounting Technology: SMT; Category: Diode
F?#1 = PPTC: Resettable Fuse; Manufacturer: Generic Brand; Max Voltage: ? V; Hold Current: 3A; Category: Fuse; Mounting Technology: SMT; Supplier Link: http://
J?#7 = PJ-002BH: CONN PWR JACK 2.5X5.5MM SOLDER; Manufacturer: CUI Devices; PartNo: CP-002BH-ND; Supplier: DigiKey; ProductNumber: PJ-002BH; URL: https://www.digikey.com/en/products/detail/cui-devices/PJ-002BH/408447; UnitPrice: $0.74; MountType: THT
J?#8 = PINHDR_2x1: Generic Pin Header 2x1
P? = ED500XDS-3: TERM BLK 3P SIDE ENT 5.08MM PCB; Part No: EDZ500/3DS; Rated Current: 15A; Voltage: 300V; URL: https://www.digikey.com/en/products/detail/on-shore-technology-inc/EDZ500-3DS/250583; Datasheet: http://www.on-shore.com/wp-content/uploads/ED500XDS.pdf; Mounting Technology: HMT
Q?#1-Q?#4 = PMV65XP-215: MOSFET P-CH 20V 2.8A 23SOT; Gate-Source Threshold Voltage: -0.69V (typ.); Drain-Source Breakdown Voltage: -20V; Drain Current: -2.8A (max.); Max Gate-Source Voltage: 12V (abs.); Supplier Part No: 1727-3124-1-ND; Supplier: DigiKey; Supplier Link: https://www.digikey.com/en/products/detail/nexperia-usa-inc/PMV65XP-215/949643; Mounting Technology: SMT; Package: SOT-23; Alternative Supplier: Chipdip; Alternative Supplier Link: https://www.chipdip.by/product/pmv65xp.215; Alternative Supplier Part No: 9000037397
R?#45-R?#47 = R: as R?#1 on sheet Hub; Tolerance: ?; Supplier Link: http://; Category: Resistor; Mounting Technology: SMT
  R?#45: Value: 10K
  R?#46 R?#47: Value: 56K
R?#48 R?#49 = R: as R?#36 on sheet Ports; Tolerance: ?; Manufacturer Part No: *; Supplier: *; Supplier Link: http://; Supplier Part No: *; Category: Resistor; Mounting Technology: SMT
  R?#48: Value: 560R
  R?#49: Value: 0R
SH?#1-SH?#6 = SH-30/57: Screw Hole D3.0/5.7 T/B
TP?#24-TP?#31 = Test Point: Test Point / Pad
U?#8 = LM397MF: IC COMPARATOR VOLT SGL SOT23-5; Manufacturer: Texas Instruments; Product Number: LM397MFX/NOPB; Supplier Part No: LM397MFX/NOPBCT-ND; Supplier: DigiKey; Alternative Supplier: Chipdip; Alternative Supplier Link: https://www.chipdip.by/product/lm397mf-nopb; Alternative Supplier Part No: 9000014932; Supplier Link: https://www.digikey.com/en/products/detail/texas-instruments/LM397MFX-NOPB/1871434; Mounting Technology: SMT; Package: SOT-23-5; Category: IC
U?#9 = LM1117: Voltage Regulator Linear 1% 800mA SOT-223; Manufacturer: Texas Instruments; VIN_MAX: +15V; Case: SOT-223; Product Number: LM1117IMP-3.3; Supplier: Chipdip; Supplier Link: https://www.chipdip.by/product/lm1117imp-3.3-nopb-2; Supplier Part No: 5641124530; Mounting Type: SMT

## Sheet PortSwitch.SchDoc: Managed USB 2.0 Hub w/ Power Meter
size A4; Date: 2021/07/01; DrawnBy: A.G.; DocumentNumber: 1; Revision: A; SheetNumber: 5; SheetTotal: 7; ProjectName: USBHUB.PrjPcb
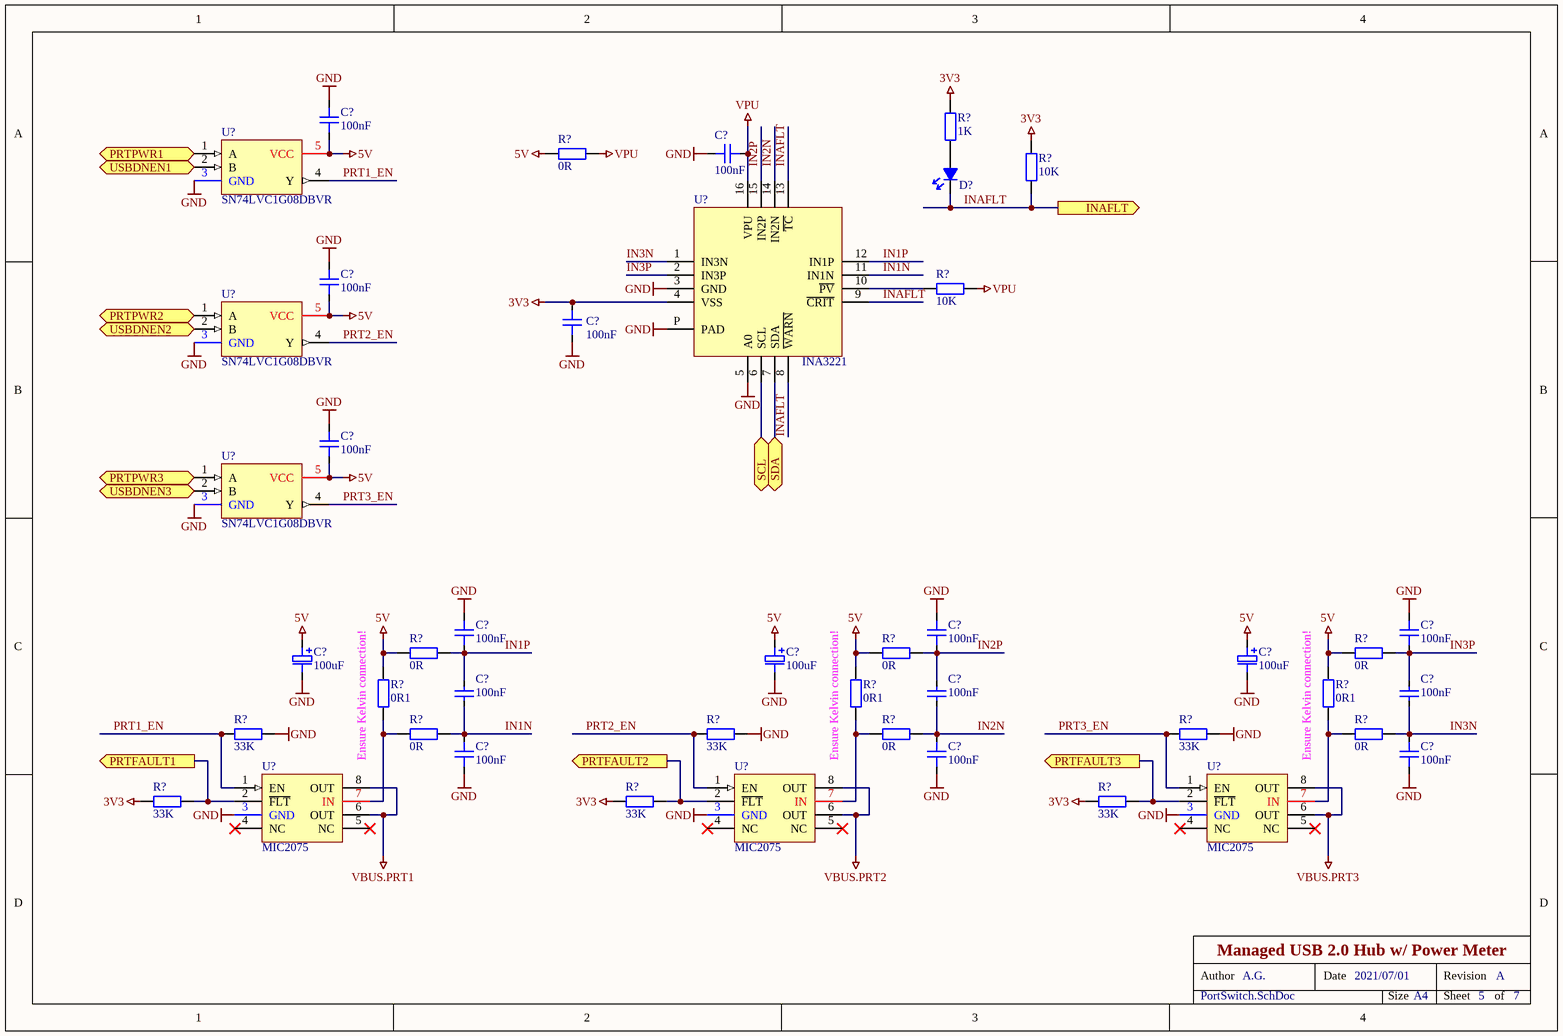
[diagram p4: PortSwitch.SchDoc]

### Parts
(Parts that share a designator on the sheet are numbered #1, #2 ... from top to bottom, then left to right.)
C?#35  100nF  [0603C_RF_M]
C?#36  100nF  [0603C_RF_M]
C?#37  100nF  [0603C_RF_M]
C?#38  100nF  [0603C_RF_M]
C?#39  100nF  [0603C_RF_M]
C?#40  100nF  [0603C_RF_M]
C?#41  100nF  [0603C_RF_M]
C?#42  100nF  [0603C_RF_M]
C?#43  100uF  [C_EL_B_4MM_RF_M]
C?#44  100uF  [C_EL_B_4MM_RF_M]
C?#45  100uF  [C_EL_B_4MM_RF_M]
C?#46  100nF  [0603C_RF_M]
C?#47  100nF  [0603C_RF_M]
C?#48  100nF  [0603C_RF_M]
C?#49  100nF  [0603C_RF_M]
C?#50  100nF  [0603C_RF_M]
C?#51  100nF  [0603C_RF_M]
D?#6  Unspecified  [0805LED_RF_M]  (value not drawn)
R?#50  10K  [0603R_RF_M]
R?#51  0R  [0603R_RF_M]
R?#52  1K  [0603R_RF_M]
R?#53  10K  [0603R_RF_M]
R?#54  0R  [0603R_RF_M]
R?#55  0R  [0603R_RF_M]
R?#56  0R  [0603R_RF_M]
R?#57  0R1  [0603R_RF_M]
R?#58  0R1  [0603R_RF_M]
R?#59  0R1  [0603R_RF_M]
R?#60  33K  [0603R_RF_M]
R?#61  0R  [0603R_RF_M]
R?#62  33K  [0603R_RF_M]
R?#63  0R  [0603R_RF_M]
R?#64  33K  [0603R_RF_M]
R?#65  0R  [0603R_RF_M]
R?#66  33K  [0603R_RF_M]
R?#67  33K  [0603R_RF_M]
R?#68  33K  [0603R_RF_M]
U?#10  SN74LVC1G08DBVR  [TI_SOT-23-5]
U?#11  INA3221  [TI_QFN-16_RF_M]
U?#12  SN74LVC1G08DBVR  [TI_SOT-23-5]
U?#13  SN74LVC1G08DBVR  [TI_SOT-23-5]
U?#14  MIC2075  [SOIC-8]
U?#15  MIC2075  [SOIC-8]
U?#16  MIC2075  [SOIC-8]

### Ports
INAFLT (out), PRTFAULT1 (out), PRTFAULT2 (out), PRTFAULT3 (out), PRTPWR1 (in), PRTPWR2 (in), PRTPWR3 (in), SCL (bidir), SDA (bidir), USBDNEN1 (in), USBDNEN2 (in), USBDNEN3 (in)

### Nets
3V3: C?#38.2 R?#50.1 R?#52.2 R?#66.1 R?#67.1 R?#68.1 U?#11.4(VSS)
5V: C?#35.2 C?#37.2 C?#39.2 C?#43.P C?#44.P C?#45.P R?#51.1 R?#54.1 R?#55.1 R?#56.1 R?#57.2 R?#58.2 R?#59.2 U?#10.5(VCC) U?#12.5(VCC) U?#13.5(VCC)
GND: C?#35.1 C?#36.1 C?#37.1 C?#38.1 C?#39.1 C?#40.2 C?#41.2 C?#42.2 C?#43.N C?#44.N C?#45.N C?#49.1 C?#50.1 C?#51.1 R?#60.1 R?#62.1 R?#64.1 U?#10.3(GND) U?#11.3(GND) U?#11.5(A0) U?#11.P(PAD) U?#12.3(GND) U?#13.3(GND) U?#14.3(GND) U?#15.3(GND) U?#16.3(GND)
VBUS.PRT1: U?#14.6(OUT) U?#14.8(OUT)
VBUS.PRT2: U?#15.6(OUT) U?#15.8(OUT)
VBUS.PRT3: U?#16.6(OUT) U?#16.8(OUT)
VPU: C?#36.2 R?#51.2 R?#53.1 U?#11.16(VPU)
IN1N: C?#46.1 C?#49.2 R?#61.2 U?#11.11(IN1N)
IN1P: C?#40.1 C?#46.2 R?#54.2 U?#11.12(IN1P)
IN2N: C?#47.1 C?#50.2 R?#63.2 U?#11.14(IN2N)
IN2P: C?#41.1 C?#47.2 R?#55.2 U?#11.15(IN2P)
IN3N: C?#48.1 C?#51.2 R?#65.2 U?#11.1(IN3N)
IN3P: C?#42.1 C?#48.2 R?#56.2 U?#11.2(IN3P)
INAFLT: D?#6.C R?#50.2 U?#11.8(~{WARN}) U?#11.9(~{CRIT}) U?#11.13(~{TC}) ; port INAFLT
PRT1_EN: R?#60.2 U?#10.4(Y) U?#14.1(EN)
PRT2_EN: R?#62.2 U?#12.4(Y) U?#15.1(EN)
PRT3_EN: R?#64.2 U?#13.4(Y) U?#16.1(EN)
PRTFAULT1: R?#66.2 U?#14.2(~{FLT}) ; port PRTFAULT1
PRTFAULT2: R?#67.2 U?#15.2(~{FLT}) ; port PRTFAULT2
PRTFAULT3: R?#68.2 U?#16.2(~{FLT}) ; port PRTFAULT3
PRTPWR1: U?#10.1(A) ; port PRTPWR1
PRTPWR2: U?#12.1(A) ; port PRTPWR2
PRTPWR3: U?#13.1(A) ; port PRTPWR3
SCL: U?#11.6(SCL) ; port SCL
SDA: U?#11.7(SDA) ; port SDA
USBDNEN1: U?#10.2(B) ; port USBDNEN1
USBDNEN2: U?#12.2(B) ; port USBDNEN2
USBDNEN3: U?#13.2(B) ; port USBDNEN3
NetD?#6_A: D?#6.A R?#52.1
NetR?#53_2: R?#53.2 U?#11.10(~{PV})
NetR?#57_1: R?#57.1 R?#61.1 U?#14.7(IN)
NetR?#58_1: R?#58.1 R?#63.1 U?#15.7(IN)
NetR?#59_1: R?#59.1 R?#65.1 U?#16.7(IN)

Not connected (* = marked no-connect by the designer): U?#14 4(NC)* 5(NC)*; U?#15 4(NC)* 5(NC)*; U?#16 4(NC)* 5(NC)*

### Notes on the sheet
- (near R?#57) Ensure Kelvin connection!
- (near R?#58) Ensure Kelvin connection!
- (near R?#59) Ensure Kelvin connection!
- Author
- Date
- Revision
- Size
- A4
- Sheet
- of

### Library data of the parts
C?#35-C?#42 C?#46-C?#51 = C: as C?#1 on sheet Hub; Value: 100nF; Tolerance: ?; Manufacturer Part No: *; Supplier: *; Supplier Link: http://; Supplier Part No: *; Category: Capacitor; Mounting Technology: SMT
  C?#40-C?#42 C?#46-C?#51: Tag: *
C?#43-C?#45 = C-P: Polarized Capacitor; Manufacturer: Generic Brand; Max Voltage: ? V; Value: 100uF; Mounting Technology: SMT; Tolerance: ?; Tag: *; Manufacturer Part No: *; Supplier: *; Supplier Link: http://; Supplier Part No: *; Category: Capacitor
D?#6 = LED: as D?#1 on sheet Ports; Emitting Color: Unspecified; Manufacturer Part No: *; Supplier: *; Supplier Link: http://; Supplier Part No: *; Category: Diode; Mounting Technology: SMT
R?#50-R?#68 = R: as R?#1 on sheet Hub; Tolerance: ?; Supplier Link: http://; Category: Resistor; Mounting Technology: SMT
  R?#50 R?#53: Value: 10K
  R?#51 R?#54-R?#56 R?#61 R?#63 R?#65: Value: 0R
  R?#52: Value: 1K
  R?#57-R?#59: Value: 0R1
  R?#60 R?#62 R?#64 R?#66-R?#68: Value: 33K
U?#10 U?#12 U?#13 = SN74LVC1G08DBVR: IC GATE AND 1CH 2-INP SOT23-5; Manufacturer: Texas Instruments; Supply Voltage: 1.65V~5.5V; Product Number: SN74LVC1G08DBVR; Supplier: DigiKey; Supplier Link: https://www.digikey.com/en/products/detail/texas-instruments/SN74LVC1G08DBVR/385718; Supplier Part No: 296-11601-1-ND; Mounting Technology: SMT; Package: SOT-23-5; Alternative Supplier: Chipdip; Alternative Supplier Link: https://www.chipdip.by/product/sn74lvc1g08dbvr-2; Alternative Supplier Part No: 9000043235
U?#11 = INA3221: IC CURRENT SHUNT MONITOR 16VQFN; Manufacturer: Texas Instruments; Supplier: DigiKey; Supplier Part No: 296-INA3221AIRGVRCT-ND; Supplier Link: https://www.digikey.com/en/products/detail/texas-instruments/INA3221AIRGVR/3588826; Mounting Technology: SMT; Package: VQFN-16; Category: IC
U?#14-U?#16 = MIC2075: IC PWR SWITCH N-CHAN 1:1 500MA; Manufacturer: Microchip Technology; Product Number: MIC2075-2YM-TR; Supplier: DigiKey; Supplier Link: https://www.digikey.com/en/products/detail/microchip-technology/MIC2075-2YM-TR/1616766; Supplier Part No: MIC2075-2YM-CT-ND; Mounting Technology: SMT; Package: SOIC-8; Category: IC

## Sheet UpstreamPort.SchDoc: Managed USB 2.0 Hub w/ Power Meter
size A4; Date: 2021/07/01; DrawnBy: A.G.; DocumentNumber: 1; Revision: A; SheetNumber: 6; SheetTotal: 7; ProjectName: USBHUB.PrjPcb
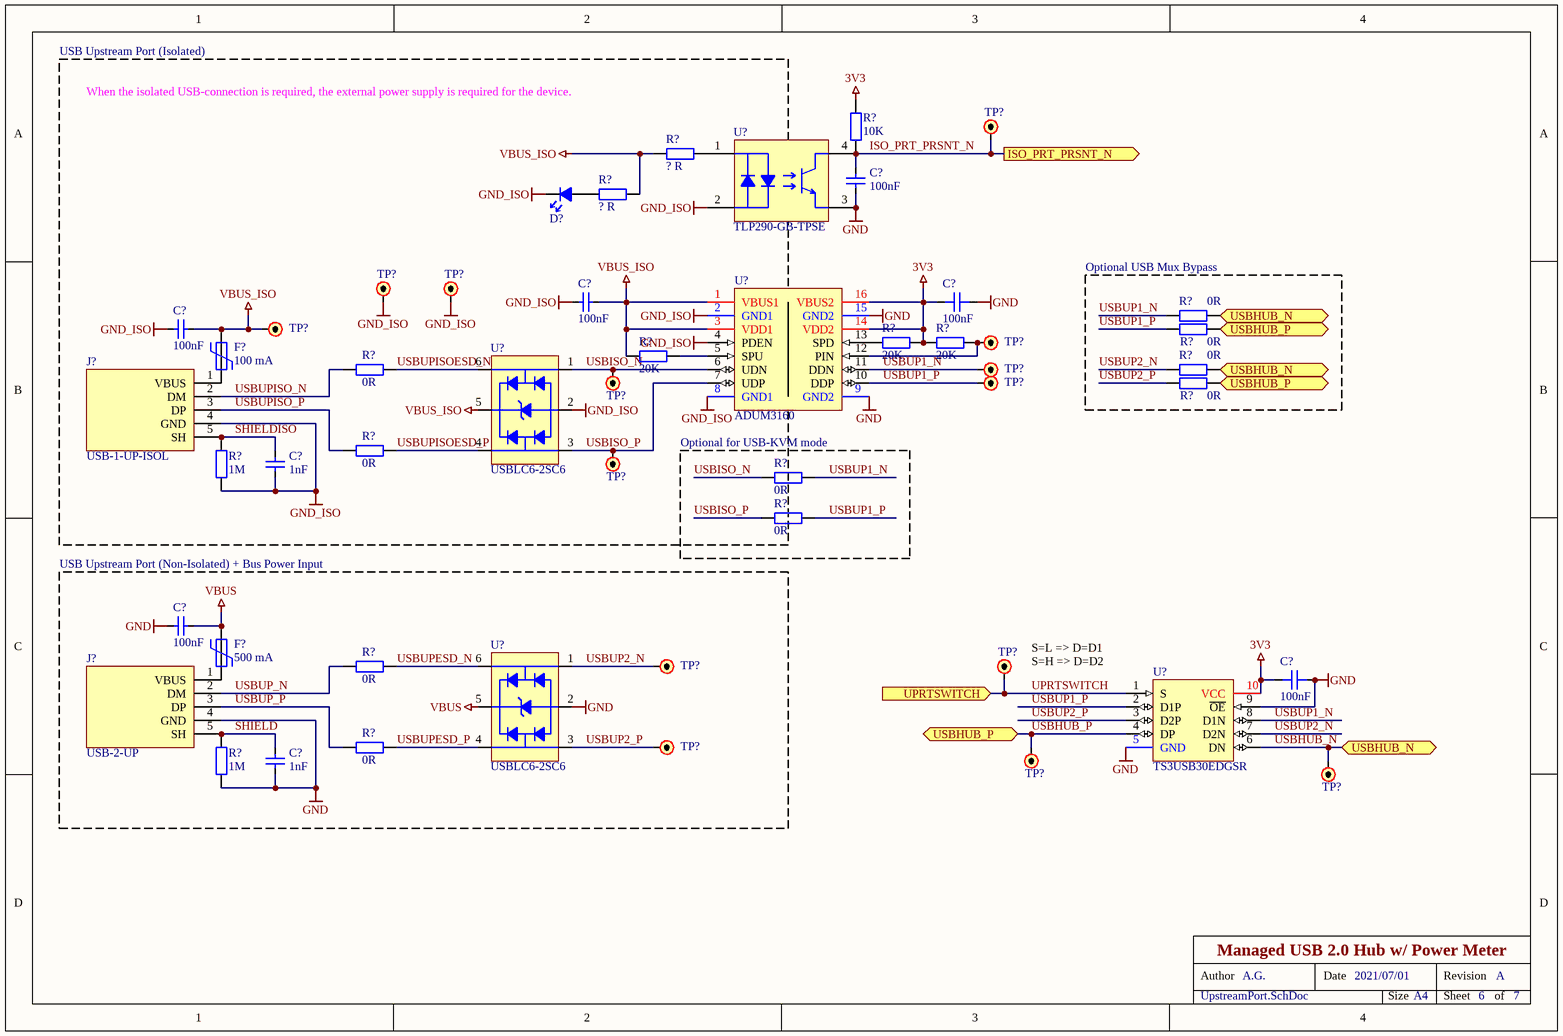
[diagram p5: UpstreamPort.SchDoc]

### Parts
(Parts that share a designator on the sheet are numbered #1, #2 ... from top to bottom, then left to right.)
C?#52  100nF  [0603C_RF_M]
C?#53  100nF  [1206C_RF_M]
C?#54  100nF  [1206C_RF_M]
C?#55  100nF  [1206C_RF_M]
C?#56  1nF  [0603C_RF_M]
C?#57  100nF  [1206C_RF_M]
C?#58  100nF  [1206C_RF_M]
C?#59  1nF  [0603C_RF_M]
D?#7  Unspecified  [0805LED_RF_M]  (value not drawn)
F?#2  100 mA  [BOURNS_MF-MSMF110/16-2_RF_H]
F?#3  500 mA  [BOURNS_MF-MSMF110/16-2_RF_H]
J?#9  USB-1-UP-ISOL  [UJ2-BH-2-TH]
J?#10  USB-2-UP  [UJ2-BH-2-TH]
R?#69  10K  [0603R_RF_M]
R?#70  ? R  [0603R_RF_M]
R?#71  ? R  [0603R_RF_M]
R?#72  0R  [0603R_RF_M]
R?#73  0R  [0603R_RF_M]
R?#74  20K  [0603R_RF_M]
R?#75  20K  [0603R_RF_M]
R?#76  20K  [0603R_RF_M]
R?#77  0R  [0603R_RF_M]
R?#78  0R  [0603R_RF_M]
R?#79  0R  [0603R_RF_M]
R?#80  0R  [0603R_RF_M]
R?#81  0R  [0603R_RF_M]
R?#82  1M  [0603R_RF_M]
R?#83  0R  [0603R_RF_M]
R?#84  0R  [0603R_RF_M]
R?#85  0R  [0603R_RF_M]
R?#86  1M  [0603R_RF_M]
TP?#32  Test Point  [PAD_R_1.5MM]  (value not drawn)
TP?#33  Test Point  [PAD_R_1.5MM]  (value not drawn)
TP?#34  Test Point  [PAD_R_1.5MM]  (value not drawn)
TP?#35  Test Point  [PAD_R_1.5MM]  (value not drawn)
TP?#36  Test Point  [PAD_R_1.5MM]  (value not drawn)
TP?#37  Test Point  [PAD_R_1.5MM]  (value not drawn)
TP?#38  Test Point  [PAD_R_1.5MM]  (value not drawn)
TP?#39  Test Point  [PAD_R_1.5MM]  (value not drawn)
TP?#40  Test Point  [PAD_R_1.5MM]  (value not drawn)
TP?#41  Test Point  [PAD_R_1.5MM]  (value not drawn)
TP?#42  Test Point  [PAD_R_1.5MM]  (value not drawn)
TP?#43  Test Point  [PAD_R_1.5MM]  (value not drawn)
TP?#44  Test Point  [PAD_R_1.5MM]  (value not drawn)
TP?#45  Test Point  [PAD_R_1.5MM]  (value not drawn)
U?#17  TLP290-GB-TPSE  [SO-4-SOIC127P600-8N]
U?#18  ADUM3160  [ADUM3160_SOP-16_RF_M]
U?#19  USBLC6-2SC6  [TI_SOT-23-6]
U?#20  TS3USB30EDGSR  [TI_VSSOP-10_RF_M]
U?#21  USBLC6-2SC6  [TI_SOT-23-6]

### Blocks framed on the sheet
USB Upstream Port (Isolated): C?#53 C?#55 C?#56 D?#7 F?#2 J?#9 R?#70 R?#71 R?#76 R?#77 R?#80 R?#82 TP?#33-TP?#35 TP?#37 TP?#40 U?#17 U?#19
Optional USB Mux Bypass: R?#72 R?#73 R?#78 R?#79
Optional for USB-KVM mode: R?#81 R?#83
USB Upstream Port (Non-Isolated) + Bus Power Input: C?#57 C?#59 F?#3 J?#10 R?#84-R?#86 TP?#41 TP?#43 U?#21

### Ports
ISO_PRT_PRSNT_N (out), UPRTSWITCH (in), USBHUB_N (bidir), USBHUB_P (bidir)

### Nets
3V3: C?#54.1 C?#58.1 R?#69.1 R?#74.2 R?#75.1 U?#18.14(VDD2) U?#18.16(VBUS2) U?#20.10(VCC)
GND: C?#52.1 C?#54.2 C?#57.2 C?#58.2 C?#59.1 J?#10.4(GND) R?#86.1 U?#17.3 U?#18.9(GND2) U?#18.15(GND2) U?#20.5(GND) U?#20.9(~{OE}) U?#21.2
GND_ISO: C?#53.2 C?#55.2 C?#56.1 D?#7.C J?#9.4(GND) R?#82.1 TP?#33.1 TP?#34.1 U?#17.2 U?#18.2(GND1) U?#18.4(PDEN) U?#18.8(GND1) U?#19.2
VBUS: C?#57.1 F?#3.2 U?#21.5
VBUS_ISO: C?#53.1 C?#55.1 F?#2.2 R?#70.1 R?#71.1 R?#76.1 TP?#35.1 U?#18.1(VBUS1) U?#18.3(VDD1) U?#19.5
ISO_PRT_PRSNT_N: C?#52.2 R?#69.2 TP?#32.1 U?#17.4 ; port ISO_PRT_PRSNT_N
SHIELD: C?#59.2 J?#10.5(SH) R?#86.2
SHIELDISO: C?#56.2 J?#9.5(SH) R?#82.2
UPRTSWITCH: TP?#42.1 U?#20.1(S) ; port UPRTSWITCH
USBHUB_N: R?#72.2 R?#78.2 TP?#45.1 U?#20.6(DN) ; port USBHUB_N
USBHUB_P: R?#73.2 R?#79.2 TP?#44.1 U?#20.4(DP) ; port USBHUB_P
USBISO_N: R?#81.2 TP?#37.1 U?#18.6(UDN) U?#19.1
USBISO_P: R?#83.2 TP?#40.1 U?#18.7(UDP) U?#19.3
USBUP1_N: R?#72.1 R?#81.1 TP?#38.1 U?#18.11(DDN) U?#20.8(D1N)
USBUP1_P: R?#73.1 R?#83.1 TP?#39.1 U?#18.10(DDP) U?#20.2(D1P)
USBUP2_N: R?#78.1 TP?#41.1 U?#20.7(D2N) U?#21.1
USBUP2_P: R?#79.1 TP?#43.1 U?#20.3(D2P) U?#21.3
USBUP_N: J?#10.2(DM) R?#84.2
USBUP_P: J?#10.3(DP) R?#85.2
USBUPESD_N: R?#84.1 U?#21.6
USBUPESD_P: R?#85.1 U?#21.4
USBUPISO_N: J?#9.2(DM) R?#77.2
USBUPISO_P: J?#9.3(DP) R?#80.2
USBUPISOESD_N: R?#77.1 U?#19.6
USBUPISOESD_P: R?#80.1 U?#19.4
NetD?#7_A: D?#7.A R?#71.2
NetF?#2_1: F?#2.1 J?#9.1(VBUS)
NetF?#3_1: F?#3.1 J?#10.1(VBUS)
NetR?#70_2: R?#70.2 U?#17.1
NetR?#74_1: R?#74.1 U?#18.13(SPD)
NetR?#75_2: R?#75.2 TP?#36.1 U?#18.12(PIN)
NetR?#76_2: R?#76.2 U?#18.5(SPU)

### Notes on the sheet
- When the isolated USB-connection is required, the external power supply is required for the device.
- (near TP?#42) S=L => D=D1
  S=H => D=D2
- Author
- Date
- Revision
- Size
- A4
- Sheet
- of

### Library data of the parts
C?#52-C?#59 = C: as C?#1 on sheet Hub; Tolerance: ?; Manufacturer Part No: *; Supplier: *; Supplier Link: http://; Supplier Part No: *; Category: Capacitor; Mounting Technology: SMT
  C?#52-C?#55 C?#57 C?#58: Value: 100nF
  C?#56 C?#59: Value: 1nF
D?#7 = LED: as D?#1 on sheet Ports; Emitting Color: Unspecified; Manufacturer Part No: *; Supplier: *; Supplier Link: http://; Supplier Part No: *; Category: Diode; Mounting Technology: SMT
F?#2 F?#3 = PPTC: as F?#1 on sheet PowerSupply; Category: Fuse; Mounting Technology: SMT; Supplier Link: http://
  F?#2: Hold Current: 100 mA
  F?#3: Hold Current: 500 mA
J?#9 J?#10 = USBB-1J: USB Type B Receptacle; pin to pad: 5>SH; Manufacturer: Connfly; Product Number: USBB-1J (DS1099-WN0); Mounting Type: THT; Case: USB Type B; Supplier: Chipdip; Supplier Link: https://www.chipdip.by/product/usbb-1j; Supplier Part No: 249636968
R?#69-R?#76 R?#78 R?#79 R?#81 R?#83 = R: as R?#1 on sheet Hub; Tolerance: ?; Supplier Link: http://; Category: Resistor; Mounting Technology: SMT
  R?#69: Value: 10K
  R?#70 R?#71: Value: ? R
  R?#72 R?#73 R?#78 R?#79 R?#81 R?#83: Value: 0R
  R?#74-R?#76: Value: 20K
R?#77 R?#80 R?#82 R?#84-R?#86 = R: as R?#36 on sheet Ports; Tolerance: ?; Manufacturer Part No: *; Supplier: *; Supplier Link: http://; Supplier Part No: *; Category: Resistor; Mounting Technology: SMT
  R?#77 R?#80 R?#84 R?#85: Value: 0R
  R?#82 R?#86: Value: 1M
TP?#32-TP?#45 = Test Point: Test Point / Pad
U?#17 = TLP290-GB-TPSE: OPTOISOLATOR 3.75KV TRANS 4-SO; URL: https://www.digikey.co.uk/product-detail/en/toshiba-semiconductor-and-storage/TLP290-GB-TPSE/TLP290-GB-TPSECT-ND/4562941; MountingTechnology: SMT
U?#18 = ADUM3160: DGT ISOL 2500VRMS 2CH USB 16SOIC; Manufacturer: Analog Devices Inc.; Product Number: ADUM3160BRWZ-RL; Mounting Technology: SMT; Package: SOP-16; Supplier: DigiKey; Alternative Supplier: Belchip; Supplier Link: https://www.digikey.com/en/products/detail/analog-devices-inc/ADUM3160BRWZ-RL/2606661; Supplier Part No: ADUM3160BRWZ-RLCT-ND; Alternative Supplier Link: https://belchip.by/product/?selected_product=43702; Alternative Supplier Part No: 43702
U?#19 U?#21 = USBLC6-2SC6: as U?#5 on sheet Ports; Supplier Link: https://www.chipdip.by/product/usblc6-2sc6; Supplier Part No: 9000039051; Supplier: Chipdip; Case: SOT-23-6; Mounting Type: SMT; Product Name: USBLC6-2SC6
U?#20 = TS3USB30EDGSR: IC USB SWITCH SGL 1X2 10MSOP; Manufacturer: Texas Instruments; Supplier Link: https://www.digikey.com/en/products/detail/texas-instruments/TS3USB30EDGSR/2193086; Supplier: DigiKey; Supplier Part No: 296-25495-1-ND; Mounting Technology: SMT; Product Number: TS3USB30EDGSR; Category: IC; Package: MSOP-10

## Sheet SMPS.SchDoc: Managed USB 2.0 Hub w/ Power Meter
size A4; Date: 2021/07/01; DrawnBy: A.G.; DocumentNumber: 1; Revision: A; SheetNumber: 7; SheetTotal: 7; ProjectName: USBHUB.PrjPcb
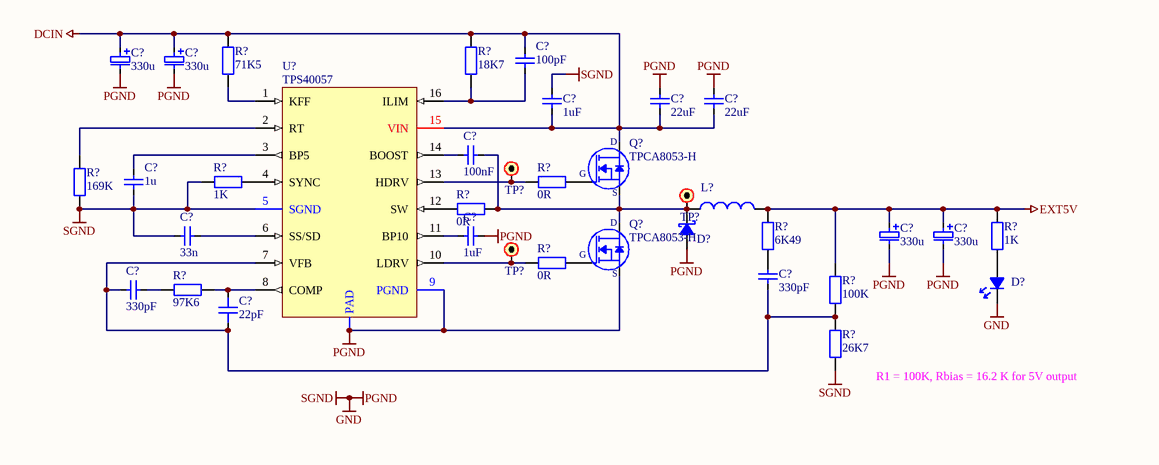
[diagram p6: SMPS.SchDoc]

### Parts
(Parts that share a designator on the sheet are numbered #1, #2 ... from top to bottom, then left to right.)
C?#60  330u  [C_EL_B_4MM_RF_M]
C?#61  330u  [C_EL_B_4MM_RF_M]
C?#62  100pF  [0805C_RF_M]
C?#63  1uF  [0805C_RF_M]
C?#64  22uF  [0805C_RF_M]
C?#65  22uF  [0805C_RF_M]
C?#66  100nF  [0805C_RF_M]
C?#67  1u  [0805C_RF_M]
C?#68  33n  [0805C_RF_M]
C?#69  1uF  [0805C_RF_M]
C?#70  330u  [C_EL_B_4MM_RF_M]
C?#71  330u  [C_EL_B_4MM_RF_M]
C?#72  330pF  [0805C_RF_M]
C?#73  330pF  [0805C_RF_M]
C?#74  22pF  [0805C_RF_M]
D?#8  Schottky  [ONSEMI_DO214AB_RF_M]  (value not drawn)
D?#9  LED  [0805LED_RF_M]  (value not drawn)
L?  6.1 uH  [CDEP147]  (value not drawn)
Q?#5  TPCA8053-H  [DFN-8]
Q?#6  TPCA8053-H  [DFN-8]
R?#87  71K5  [0805R_RF_M]
R?#88  18K7  [0805R_RF_M]
R?#89  1K  [0805R_RF_M]
R?#90  0R  [0805R_RF_M]
R?#91  169K  [0805R_RF_M]
R?#92  0R  [0805R_RF_M]
R?#93  6K49  [0805R_RF_M]
R?#94  0R  [0805R_RF_M]
R?#95  100K  [0805R_RF_M]
R?#96  1K  [0603R_RF_M]
R?#97  97K6  [0805R_RF_M]
R?#98  26K7  [0805R_RF_M]
TP?#46  Test Point  [PAD_R_1.5MM]  (value not drawn)
TP?#47  Test Point  [PAD_R_1.5MM]  (value not drawn)
TP?#48  Test Point  [PAD_R_1.5MM]  (value not drawn)
U?#22  TPS40057  [TI_HTSSOP-16]

### Nets
DCIN: C?#60.P C?#61.P C?#62.2 C?#63.2 C?#64.2 C?#65.2 Q?#5.3(D) R?#87.2 R?#88.2 U?#22.15(VIN)
EXT5V: C?#70.P C?#71.P L?.2 R?#93.1 R?#95.1 R?#96.2
GND: C?#60.N C?#61.N C?#63.1 C?#64.1 C?#65.1 C?#67.1 C?#68.1 C?#69.1 C?#70.N C?#71.N D?#8.A D?#9.C Q?#6.2(S) R?#89.1 R?#91.1 R?#98.2 U?#22.5(SGND) U?#22.9(PGND) U?#22.PAD  [also labelled PGND, SGND]
NetC?#62_1: C?#62.1 R?#88.1 U?#22.16(ILIM)
NetC?#66_1: C?#66.1 D?#8.C L?.1 Q?#5.2(S) Q?#6.3(D) R?#92.2 TP?#47.1
NetC?#66_2: C?#66.2 U?#22.14(BOOST)
NetC?#67_2: C?#67.2 U?#22.3(BP5)
NetC?#68_2: C?#68.2 U?#22.6(SS/SD)
NetC?#69_2: C?#69.2 U?#22.11(BP10)
NetC?#72_1: C?#72.1 R?#93.2
NetC?#72_2: C?#72.2 C?#73.1 C?#74.2 R?#95.2 R?#98.1 U?#22.7(VFB)
NetC?#73_2: C?#73.2 R?#97.1
NetC?#74_1: C?#74.1 R?#97.2 U?#22.8(COMP)
NetD?#9_A: D?#9.A R?#96.1
NetQ?#5_1: Q?#5.1(G) R?#90.2
NetQ?#6_1: Q?#6.1(G) R?#94.2
NetR?#87_1: R?#87.1 U?#22.1(KFF)
NetR?#89_2: R?#89.2 U?#22.4(SYNC)
NetR?#90_1: R?#90.1 TP?#46.1 U?#22.13(HDRV)
NetR?#91_2: R?#91.2 U?#22.2(RT)
NetR?#92_1: R?#92.1 U?#22.12(SW)
NetR?#94_1: R?#94.1 TP?#48.1 U?#22.10(LDRV)

### Notes on the sheet
- (near R?#98) R1 = 100K, Rbias = 16.2 K for 5V output
- Author
- Date
- Revision
- Size
- A4
- Sheet
- of

### Library data of the parts
C?#60 C?#61 C?#70 C?#71 = C-P: as C?#43 on sheet PortSwitch; Value: 330u; Mounting Technology: SMT; Tolerance: ?; Tag: *; Manufacturer Part No: *; Supplier: *; Supplier Link: http://; Supplier Part No: *; Category: Capacitor
C?#62-C?#69 C?#72-C?#74 = C: as C?#1 on sheet Hub; Tolerance: ?; Mounting Technology: SMT; Tag: *; Manufacturer Part No: *; Supplier: *; Supplier Link: http://; Supplier Part No: *; Category: Capacitor
  C?#62: Value: 100pF
  C?#63 C?#69: Value: 1uF
  C?#64 C?#65: Value: 22uF
  C?#66: Value: 100nF
  C?#67: Value: 1u
  C?#68: Value: 33n
  C?#72 C?#73: Value: 330pF
  C?#74: Value: 22pF
D?#8 = D-SCHOTTKY: Schottky Diode; Manufacturer: Generic Brand; Max Forward Voltage: ? V; Power Rating: ? W; Manufacturer Part No: *; Supplier: *; Supplier Link: http://; Supplier Part No: *; Mounting Technology: SMT; Category: Diode
D?#9 = LED: as D?#5 on sheet PowerSupply; Manufacturer Part No: *; Supplier: *; Supplier Link: http://; Supplier Part No: *; Mounting Technology: SMT; Category: Diode
L? = CDEP147NP-6R1MC-125: FIXED IND 6.1UH 12.5A 6.03 MOHM; Manufacturer: Sumida America Components Inc.; Value: 6.1 uH; Mounting Technology: SMT; Category: Inductor; Product Number: CDEP147NP-6R1MC-125; Supplier Part No: CDEP147NP-6R1MC-125-ND; Supplier Link: https://www.digikey.com/en/products/detail/sumida-america-components-inc/CDEP147NP-6R1MC-125/4038408; Supplier: DigiKey; Package: Non-Standard
Q?#5 Q?#6 = TPCA8053-H: MOSFET N-CH 60V 15A; Manufacturer: Toshiba; Manufacturer Part No: *; Supplier: *; Supplier Link: *; Supplier Part No: *; Mounting Technology: SMT; Package: SO-8FL; Alternative Supplier: *; Alternative Supplier Part No: *; Alternative Supplier Link: *; Datasheet Link: http://www.farnell.com/datasheets/1339268.pdf
R?#87-R?#95 R?#97 R?#98 = R: as R?#1 on sheet Hub; Tolerance: ?; Supplier Link: http://; Category: Resistor; Mounting Technology: SMT
  R?#87: Value: 71K5
  R?#88: Value: 18K7
  R?#89: Value: 1K
  R?#90 R?#92 R?#94: Value: 0R
  R?#91: Value: 169K
  R?#93: Value: 6K49
  R?#95: Value: 100K
  R?#97: Value: 97K6
  R?#98: Value: 26K7
R?#96 = R: as R?#36 on sheet Ports; Value: 1K; Tolerance: ?; Manufacturer Part No: *; Supplier: *; Supplier Link: http://; Supplier Part No: *; Category: Resistor; Mounting Technology: SMT
TP?#46-TP?#48 = Test Point: Test Point / Pad
U?#22 = TPS40057: IC REG CTRLR BUCK 16HTSSOP; Manufacturer: Texas Instruments; Product Number: TPS40057PWPR; Mounting Technology: SMT; Supplier Link: https://www.digikey.com/en/products/detail/texas-instruments/TPS40057PWPR/1671697; Supplier: DigiKey; Supplier Part No: 296-26961-1-ND; Package: HTSSOP-16

## Sheet Decoration.SchDoc: Managed USB 2.0 Hub w/ Power Meter
size A4; Date: 2021/07/01; DrawnBy: A.G.; DocumentNumber: 1; Revision: A; SheetNumber: 1; ProjectName: USBHUB.PrjPcb
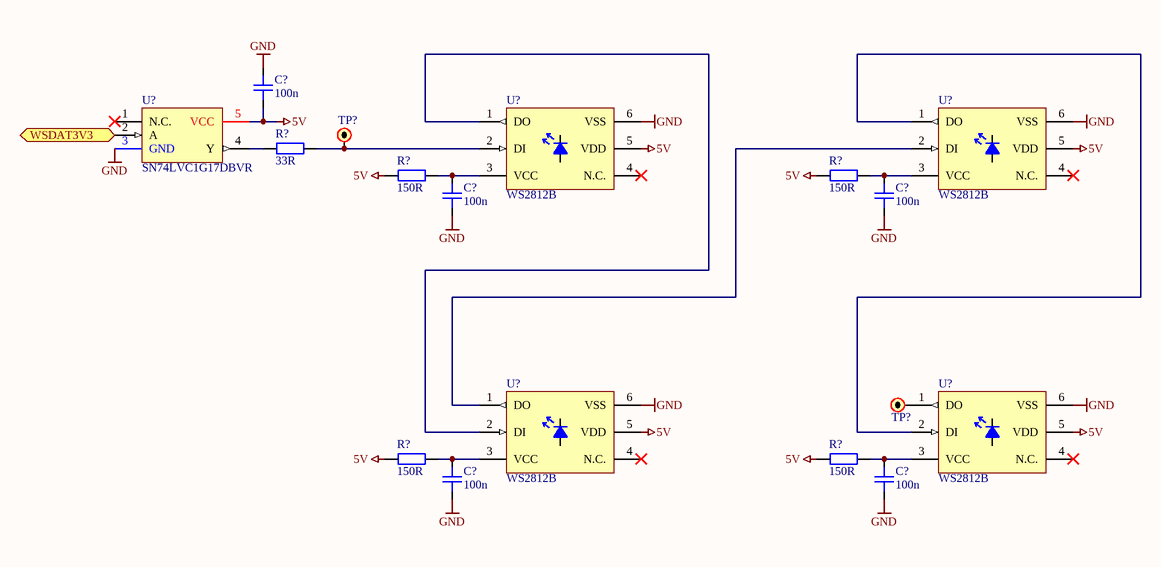
[diagram p7: Decoration.SchDoc]

### Parts
(Parts that share a designator on the sheet are numbered #1, #2 ... from top to bottom, then left to right.)
C?#75  100n  [0805C_RF_M]
C?#76  100n  [0805C_RF_M]
C?#77  100n  [0805C_RF_M]
C?#78  100n  [0805C_RF_M]
C?#79  100n  [0805C_RF_M]
R?#99  33R  [0805R_RF_M]
R?#100  150R  [0603R_RF_M]
R?#101  150R  [0603R_RF_M]
R?#102  150R  [0603R_RF_M]
R?#103  150R  [0603R_RF_M]
TP?#49  Test Point  [PAD_R_1MM]  (value not drawn)
TP?#50  Test Point  [PAD_R_1.5MM]  (value not drawn)
U?#23  WS2812B  [WS2812B]
U?#24  WS2812B  [WS2812B]
U?#25  SN74LVC1G17DBVR  [TI_SOT-23-5]
U?#26  WS2812B  [WS2812B]
U?#27  WS2812B  [WS2812B]

### Ports
WSDAT3V3 (in)

### Nets
5V: C?#75.2 R?#100.1 R?#101.1 R?#102.1 R?#103.1 U?#23.5(VDD) U?#24.5(VDD) U?#25.5(VCC) U?#26.5(VDD) U?#27.5(VDD)
GND: C?#75.1 C?#76.1 C?#77.1 C?#78.1 C?#79.1 U?#23.6(VSS) U?#24.6(VSS) U?#25.3(GND) U?#26.6(VSS) U?#27.6(VSS)
WSDAT3V3: U?#25.2(A) ; port WSDAT3V3
NetC?#76_2: C?#76.2 R?#100.2 U?#23.3(VCC)
NetC?#77_2: C?#77.2 R?#101.2 U?#24.3(VCC)
NetC?#78_2: C?#78.2 R?#102.2 U?#26.3(VCC)
NetC?#79_2: C?#79.2 R?#103.2 U?#27.3(VCC)
NetR?#99_1: R?#99.1 U?#25.4(Y)
NetR?#99_2: R?#99.2 TP?#49.1 U?#23.2(DI)
NetTP?#50_1: TP?#50.1 U?#27.1(DO)
NetU?#23_1: U?#23.1(DO) U?#26.2(DI)
NetU?#24_1: U?#24.1(DO) U?#27.2(DI)
NetU?#24_2: U?#24.2(DI) U?#26.1(DO)

Not connected (* = marked no-connect by the designer): U?#23 4(N.C.)*; U?#24 4(N.C.)*; U?#25 1(N.C.)*; U?#26 4(N.C.)*; U?#27 4(N.C.)*

### Notes on the sheet
- Author
- Date
- Revision
- Size
- A4
- Sheet
- of

### Library data of the parts
C?#75-C?#79 = C: as C?#1 on sheet Hub; Value: 100n; Tolerance: ?; Mounting Technology: SMT; Tag: *; Manufacturer Part No: *; Supplier: *; Supplier Link: http://; Supplier Part No: *; Category: Capacitor
R?#99-R?#103 = R: as R?#1 on sheet Hub; Tolerance: ?; Supplier Link: http://; Category: Resistor; Mounting Technology: SMT
  R?#99: Value: 33R
  R?#100-R?#103: Value: 150R
TP?#49 TP?#50 = Test Point: Test Point / Pad
U?#25 = SN74LVC1G17DBVR: IC BUF NON-INVERT 5.5V SOT23-5; Manufacturer: Texas Instruments; Supplier Part No: 296-11933-1-ND; Supplier URL: https://www.digikey.com/en/products/detail/texas-instruments/SN74LVC1G17DBVR/389051; Supplier Unit Price: $0.29; Supplier Packaging: Cut Tape; Manufacturer Product Number: SN74LVC1G17DBVR; Operating Temperature: -40°C ~ 125°C (TA); Mounting Type: SMT; Package: SOT-23-5

## Nets that join several sheets
3V3: Hub (20 pins), Control (22 pins), PowerSupply (11 pins), PortSwitch (7 pins), UpstreamPort (8 pins)
5V: PowerSupply (5 pins), PortSwitch (16 pins), Decoration (10 pins)
DCIN: PowerSupply (F?#1.2 P?.1), SMPS (10 pins)
EXT5V: PowerSupply (5 pins), SMPS (6 pins)
GND: Hub (22 pins), Control (17 pins), Ports (18 pins), PowerSupply (22 pins), PortSwitch (26 pins), UpstreamPort (13 pins), SMPS (19 pins), Decoration (10 pins)
VBUS: Hub (R?#2.2), PowerSupply (D?#4.1 Q?#1.3), UpstreamPort (C?#57.1 F?#3.2 U?#21.5)
VBUS.PRT1: Ports (C?#23.2 J?#4.1 R?#33.1 U?#5.5), PortSwitch (U?#14.6 U?#14.8)
VBUS.PRT2: Ports (C?#25.2 J?#5.1 R?#37.1 U?#6.5), PortSwitch (U?#15.6 U?#15.8)
VBUS.PRT3: Ports (C?#27.2 J?#6.1 R?#41.1 U?#7.5), PortSwitch (U?#16.6 U?#16.8)
HUB_NRST: Hub (C?#8.2 R?#1.1 TP?#1.1 U?#1.26), Control (R?#15.2 U?#4.16)
HUB_SCL: Hub (U?#1.24 U?#2.6), Control (R?#24.1 TP?#22.1 U?#4.7)
HUB_SDA: Hub (U?#1.22 U?#2.5), Control (R?#23.1 TP?#21.1 U?#4.6)
INAFLT: Control (U?#4.11), PortSwitch (5 pins)
ISO_PRT_PRSNT_N: Control (U?#4.12), UpstreamPort (C?#52.2 R?#69.2 TP?#32.1 U?#17.4)
PRTFAULT1: Hub (TP?#4.1 U?#1.13), Control (U?#4.31), PortSwitch (R?#66.2 U?#14.2)
PRTFAULT2: Hub (TP?#6.1 U?#1.17), Control (U?#4.32), PortSwitch (R?#67.2 U?#15.2)
PRTFAULT3: Hub (TP?#8.1 U?#1.19), Control (U?#4.34), PortSwitch (R?#68.2 U?#16.2)
PRTPWR1: Hub (TP?#3.1 U?#1.12), PortSwitch (U?#10.1)
PRTPWR2: Hub (TP?#5.1 U?#1.16), PortSwitch (U?#12.1)
PRTPWR3: Hub (TP?#7.1 U?#1.18), PortSwitch (U?#13.1)
SCL: Control (J?#2.4 R?#21.1 TP?#16.1 U?#4.9), PortSwitch (U?#11.6)
SDA: Control (J?#2.2 R?#20.1 TP?#15.1 U?#4.8), PortSwitch (U?#11.7)
UPRTSWITCH: Control (U?#4.17), UpstreamPort (TP?#42.1 U?#20.1)
USBDN1_N: Hub (U?#1.1), Ports (U?#5.3)
USBDN1_P: Hub (U?#1.2), Ports (U?#5.1)
USBDN2_N: Hub (U?#1.3), Ports (U?#6.3)
USBDN2_P: Hub (U?#1.4), Ports (U?#6.1)
USBDN3_N: Hub (U?#1.6), Ports (U?#7.3)
USBDN3_P: Hub (U?#1.7), Ports (U?#7.1)
USBDN4_N: Hub (U?#1.8), Control (R?#19.2)
USBDN4_P: Hub (U?#1.9), Control (R?#18.2)
USBDNEN1: Control (TP?#12.1 U?#4.35), PortSwitch (U?#10.2)
USBDNEN2: Control (TP?#13.1 U?#4.36), PortSwitch (U?#12.2)
USBDNEN3: Control (TP?#14.1 U?#4.37), PortSwitch (U?#13.2)
USBHUB_N: Hub (U?#1.30), UpstreamPort (R?#72.2 R?#78.2 TP?#45.1 U?#20.6)
USBHUB_P: Hub (U?#1.31), UpstreamPort (R?#73.2 R?#79.2 TP?#44.1 U?#20.4)
VBUSDET: Hub (5 pins), Control (R?#25.2)
WSDAT3V3: Control (TP?#23.1 U?#4.18), Decoration (U?#25.2)